# EAGLE design BKU (EAGLE 9.4.2)
ESKD_DESCRIPTION1: 207|235|224|242|224|32|193|209|202|49; ESKD_DESCRIPTION2: 241|245|229|236|224|32|253|235|229|234|242|240|232|247|229|241|234|224|255; ESKD_DESCRIPTION3: 239|240|232|237|246|232|239|232|224|235|252|237|224|255; ESKD_NUMBER: 67|67|83|49|46|50|50|48|48|45|48|221|51; ESKD_NUMBER_SHEET: 49; ESKD_SHEETS: 49
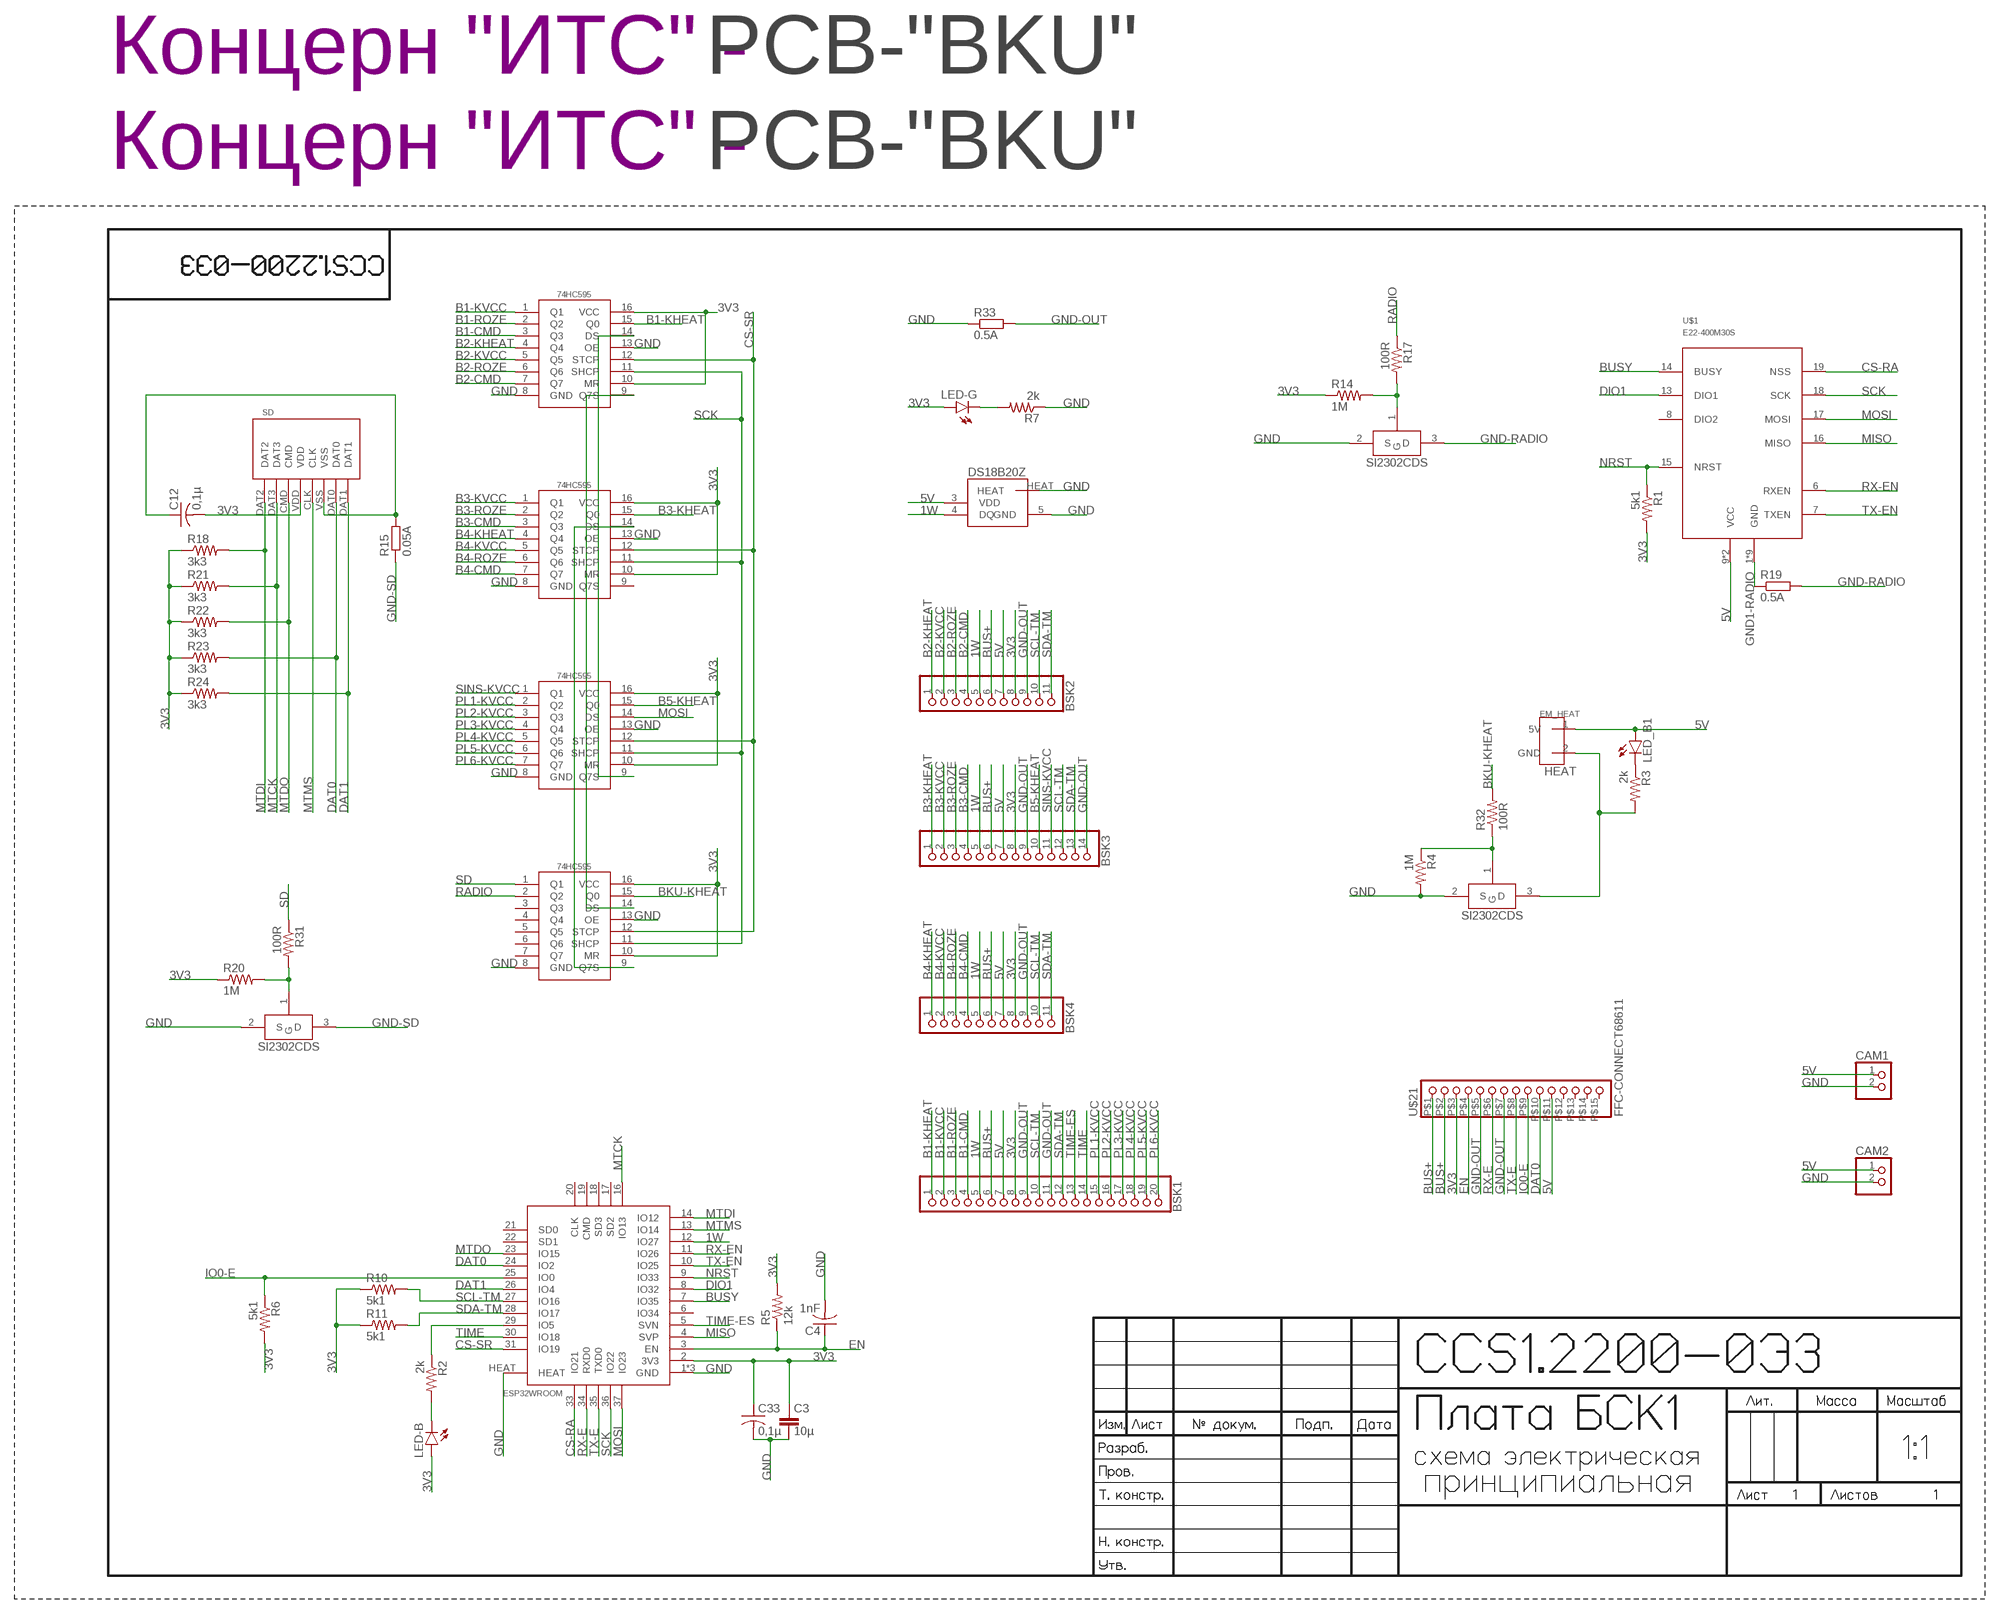
[diagram p0: schematic, sheet 1, part 1 of 2]
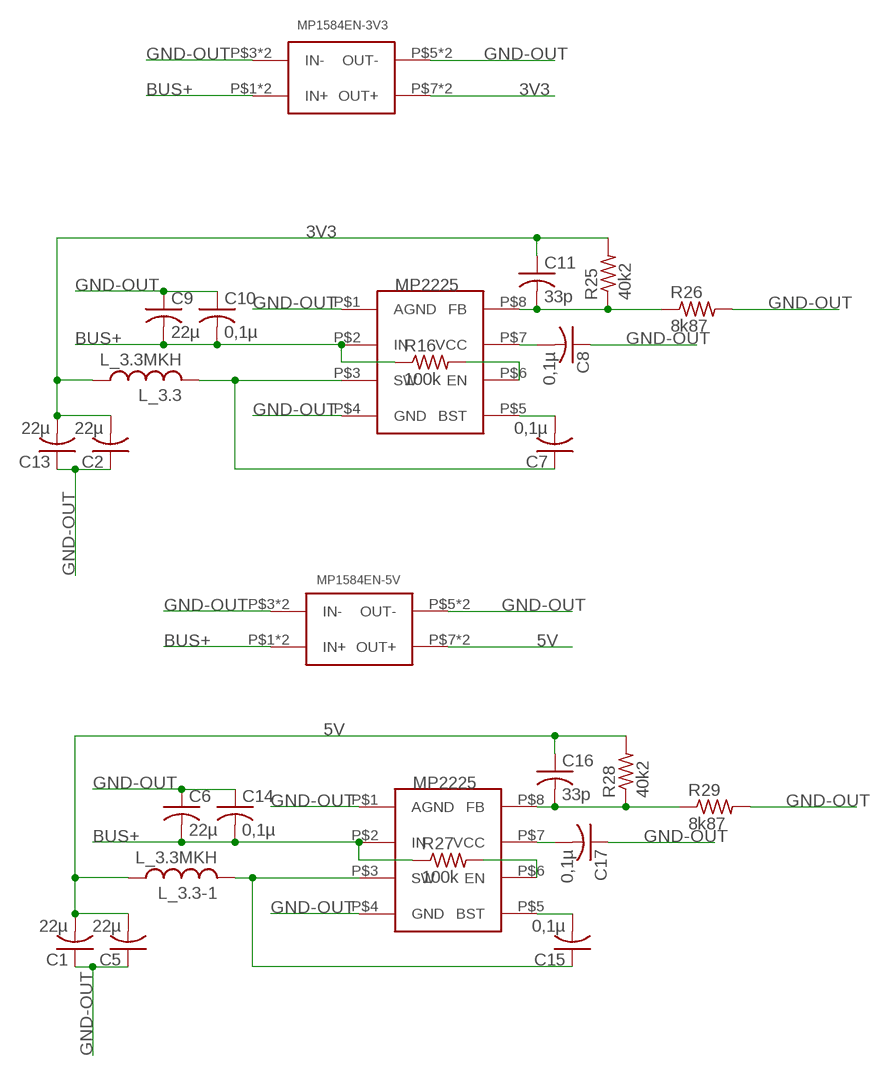
[diagram p1: schematic, sheet 1, part 2 of 2]

## Parts
74HC595#1  74HC595  [TSSOP16]
74HC595#2  74HC595  [TSSOP16]
74HC595#3  74HC595  [TSSOP16]
74HC595#4  74HC595  [TSSOP16]
BSK1  PINHD-1X20  [1X20]
BSK2  PINHD-1X11  [1X11]
BSK3  PINHD-1X14  [1X14]
BSK4  PINHD-1X11  [1X11]
C1  22µ  C-USC1206  [C1206]
C2  22µ  C-USC1206  [C1206]
C3  10µ  C-EUC1206  [C1206]
C4  1nF  C-USC0603  [C0603]
C5  22µ  C-USC1206  [C1206]
C6  22µ  C-USC1206  [C1206]
C7  0,1µ  C-USC0603  [C0603]
C8  0,1µ  C-USC0603  [C0603]
C9  22µ  C-USC1206  [C1206]
C10  0,1µ  C-USC0603  [C0603]
C11  33p  C-USC0603  [C0603]
C12  0,1µ  C-USC0603  [C0603]
C13  22µ  C-USC1206  [C1206]
C14  0,1µ  C-USC0603  [C0603]
C15  0,1µ  C-USC0603  [C0603]
C16  33p  C-USC0603  [C0603]
C17  0,1µ  C-USC0603  [C0603]
C33  0,1µ  C-USC0603  [C0603]
CAM1  PINHD-1X2  [1X02]
CAM2  PINHD-1X2  [1X02]
L_3.3  L_3.3MKH  L_3.3MKH_5X5  [L_SPM5020]
L_3.3-1  L_3.3MKH  L_3.3MKH_5X5  [L_SPM5020]
LED-B  LEDCHIPLED_0603  [CHIPLED_0603]
LED-G  LEDCHIPLED_0603  [CHIPLED_0603]
LED_B1  LEDCHIPLED_0603  [CHIPLED_0603]
MP1584EN-3V3  MP1584-B  [MP1584-B]
MP1584EN-5V  MP1584-B  [MP1584-B]
MP2225-3V3  MP2225  [TSOT23-8]
MP2225-5V  MP2225  [TSOT23-8]
R1  5k1  R-US_R0603  [R0603]
R2  2k  R-US_R0603  [R0603]
R3  2k  R-US_R0603  [R0603]
R4  1M  R-US_R0603  [R0603]
R5  12k  R-US_R0603  [R0603]
R6  5k1  R-US_R0603  [R0603]
R7  2k  R-US_R0603  [R0603]
R10  5k1  R-US_R0603  [R0603]
R11  5k1  R-US_R0603  [R0603]
R14  1M  R-US_R0603  [R0603]
R15  0.05A  R-EU_R1210  [R1210]
R16  100k  R-US_R0603  [R0603]
R17  100R  R-US_R0603  [R0603]
R18  3k3  R-US_R0603  [R0603]
R19  0.5A  R-EU_R1210  [R1210]
R20  1M  R-US_R0603  [R0603]
R21  3k3  R-US_R0603  [R0603]
R22  3k3  R-US_R0603  [R0603]
R23  3k3  R-US_R0603  [R0603]
R24  3k3  R-US_R0603  [R0603]
R25  40k2  R-US_R0603  [R0603]
R26  8k87  R-US_R0603  [R0603]
R27  100k  R-US_R0603  [R0603]
R28  40k2  R-US_R0603  [R0603]
R29  8k87  R-US_R0603  [R0603]
R31  100R  R-US_R0603  [R0603]
R32  100R  R-US_R0603  [R0603]
R33  0.5A  R-EU_R1210  [R1210]
SD  SD  [SD]
U$1  E22-400M30S  [E22-400M30S]
U$2  PCB-"BKU"  ITS-LOGOPCB-""  [ITS-LOGO]
U$3  SI2302CDS  [SOT23-3]
U$4  SI2302CDS  [SOT23-3]
U$5  DS18B20Z  [SOIC8+HEAT_S]
U$6  PCB-"BKU"  ITS-LOGOPCB-""  [ITS-LOGO]
U$13  ESP32WROOM  [ESP32WROOM]
U$21  FFC-CONNECT68611  [68611]
U$23  SI2302CDS  [SOT23-3]
U$24  EM_HEAT  [EM_HEAT]

## Nets
1W: BSK1.5 BSK2.5 BSK3.5 BSK4.5 U$5.4(DQ) U$13.12(IO27)
3: R3.2 U$23.3(D) U$24.2(GND)
3V3: 74HC595#1.10(MR) 74HC595#1.16(VCC) 74HC595#2.10(MR) 74HC595#2.16(VCC) 74HC595#3.10(MR) 74HC595#3.16(VCC) 74HC595#4.10(MR) 74HC595#4.16(VCC) BSK1.8 BSK2.8 BSK3.8 BSK4.8 C2.2 C3.1 C11.1 C12.2 C13.2 C33.1 L_3.3.P$1 LED-B.A LED-G.A MP1584EN-3V3.P$7(OUT+) MP1584EN-3V3.P$8(OUT+) R1.2 R5.2 R6.2 R10.1 R11.1 R14.1 R18.1 R20.1 R21.1 R22.1 R23.1 R24.1 R25.2 SD.VDD U$13.2(3V3) U$21.P$3
5V: BSK1.7 BSK2.7 BSK3.7 BSK4.7 C1.2 C5.2 C16.1 CAM1.1 CAM2.1 L_3.3-1.P$1 LED_B1.A MP1584EN-5V.P$7(OUT+) MP1584EN-5V.P$8(OUT+) R28.2 U$1.9(VCC) U$1.10(VCC) U$5.3(VDD) U$21.P$11 U$24.1(5V)
B1-CMD: 74HC595#1.3(Q3) BSK1.4
B1-KHEAT: 74HC595#1.15(Q0) BSK1.1
B1-KVCC: 74HC595#1.1(Q1) BSK1.2
B1-ROZE: 74HC595#1.2(Q2) BSK1.3
B2-CMD: 74HC595#1.7(Q7) BSK2.4
B2-KHEAT: 74HC595#1.4(Q4) BSK2.1
B2-KVCC: 74HC595#1.5(Q5) BSK2.2
B2-ROZE: 74HC595#1.6(Q6) BSK2.3
B3-CMD: 74HC595#2.3(Q3) BSK3.4
B3-KHEAT: 74HC595#2.15(Q0) BSK3.1
B3-KVCC: 74HC595#2.1(Q1) BSK3.2
B3-ROZE: 74HC595#2.2(Q2) BSK3.3
B4-CMD: 74HC595#2.7(Q7) BSK4.4
B4-KHEAT: 74HC595#2.4(Q4) BSK4.1
B4-KVCC: 74HC595#2.5(Q5) BSK4.2
B4-ROZE: 74HC595#2.6(Q6) BSK4.3
B5-KHEAT: 74HC595#3.15(Q0) BSK3.10
BKU-KHEAT: 74HC595#4.15(Q0) R32.2
BUS+: BSK1.6 BSK2.6 BSK3.6 BSK4.6 C6.2 C9.2 C10.2 C14.2 MP1584EN-3V3.P$1(IN+) MP1584EN-3V3.P$2(IN+) MP1584EN-5V.P$1(IN+) MP1584EN-5V.P$2(IN+) MP2225-3V3.P$2(IN) MP2225-5V.P$2(IN) R16.1 R27.1 U$21.P$1 U$21.P$2
BUSY: U$1.14(BUSY) U$13.7(IO35)
CS-RA: U$1.19(NSS) U$13.33(IO21)
CS-SR: 74HC595#1.12(STCP) 74HC595#2.12(STCP) 74HC595#3.12(STCP) 74HC595#4.12(STCP) U$13.31(IO19)
DAT0: R23.2 SD.DAT0 U$13.24(IO2) U$21.P$10
DAT1: R24.2 SD.DAT1 U$13.26(IO4)
DIO1: U$1.13(DIO1) U$13.8(IO32)
EN: C4.1 R5.1 U$13.3(EN) U$21.P$4
GND: 74HC595#1.8(GND) 74HC595#1.13(OE) 74HC595#2.8(GND) 74HC595#2.13(OE) 74HC595#3.8(GND) 74HC595#3.13(OE) 74HC595#4.8(GND) 74HC595#4.13(OE) C3.2 C4.2 C33.2 CAM1.2 CAM2.2 R4.2 R7.1 R33.1 U$3.2(S) U$4.2(S) U$5.5(GND) U$5.HEAT U$13.1(GND) U$13.15(GND) U$13.38(GND) U$13.HEAT U$23.2(S)
GND1-RADIO: R19.1 U$1.1(GND) U$1.2(GND) U$1.3(GND) U$1.4(GND) U$1.5(GND) U$1.11(GND) U$1.12(GND) U$1.20(GND) U$1.22(GND)
GND-OUT: BSK1.9 BSK1.11 BSK2.9 BSK3.9 BSK3.14 BSK4.9 C1.1 C2.1 C5.1 C6.1 C8.1 C9.1 C10.1 C13.1 C14.1 C17.1 MP1584EN-3V3.P$3(IN-) MP1584EN-3V3.P$4(IN-) MP1584EN-3V3.P$5(OUT-) MP1584EN-3V3.P$6(OUT-) MP1584EN-5V.P$3(IN-) MP1584EN-5V.P$4(IN-) MP1584EN-5V.P$5(OUT-) MP1584EN-5V.P$6(OUT-) MP2225-3V3.P$1(AGND) MP2225-3V3.P$4(GND) MP2225-5V.P$1(AGND) MP2225-5V.P$4(GND) R26.2 R29.2 R33.2 U$21.P$5 U$21.P$7
GND-RADIO: R19.2 U$4.3(D)
GND-SD: R15.1 U$3.3(D)
IO0-E: R6.1 U$13.25(IO0) U$21.P$9
IO1: R2.1 U$13.29(IO5)
MISO: U$1.16(MISO) U$13.4(SVP)
MOSI: 74HC595#3.14(DS) U$1.17(MOSI) U$13.37(IO23)
MTCK: R21.2 SD.DAT3 U$13.16(IO13)
MTDI: R18.2 SD.DAT2 U$13.14(IO12)
MTDO: R22.2 SD.CMD U$13.23(IO15)
MTMS: SD.CLK U$13.13(IO14)
N$1: 74HC595#1.9(Q7S) 74HC595#4.14(DS)
N$2: LED_B1.C R3.1
N$3: LED-G.C R7.2
N$4: LED-B.C R2.2
N$5: C12.1 R15.2 SD.VSS
N$6: R14.2 R17.2 U$4.1(G)
N$7: 74HC595#2.14(DS) 74HC595#4.9(Q7S)
N$8: C15.1 L_3.3-1.P$2 MP2225-5V.P$3(SW)
N$9: C15.2 MP2225-5V.P$5(BST)
N$10: MP2225-5V.P$6(EN) R27.2
N$11: R20.2 R31.2 U$3.1(G)
N$12: C17.2 MP2225-5V.P$7(VCC)
N$13: C7.2 MP2225-3V3.P$5(BST)
N$14: C7.1 L_3.3.P$2 MP2225-3V3.P$3(SW)
N$15: MP2225-3V3.P$6(EN) R16.2
N$16: C8.2 MP2225-3V3.P$7(VCC)
N$17: 74HC595#1.14(DS) 74HC595#3.9(Q7S)
N$20: C11.2 MP2225-3V3.P$8(FB) R25.1 R26.1
N$22: C16.2 MP2225-5V.P$8(FB) R28.1 R29.1
N$36: R4.1 R32.1 U$23.1(G)
NRST: R1.1 U$1.15(NRST) U$13.9(IO33)
PL1-KVCC: 74HC595#3.2(Q2) BSK1.15
PL2-KVCC: 74HC595#3.3(Q3) BSK1.16
PL3-KVCC: 74HC595#3.4(Q4) BSK1.17
PL4-KVCC: 74HC595#3.5(Q5) BSK1.18
PL5-KVCC: 74HC595#3.6(Q6) BSK1.19
PL6-KVCC: 74HC595#3.7(Q7) BSK1.20
RADIO: 74HC595#4.2(Q2) R17.1
RX-E: U$13.34(RXD0) U$21.P$6
RX-EN: U$1.6(RXEN) U$13.11(IO26)
SCK: 74HC595#1.11(SHCP) 74HC595#2.11(SHCP) 74HC595#3.11(SHCP) 74HC595#4.11(SHCP) U$1.18(SCK) U$13.36(IO22)
SCL-TM: BSK1.10 BSK2.10 BSK3.12 BSK4.10 R10.2 U$13.27(IO16)
SD: 74HC595#4.1(Q1) R31.1
SDA-TM: BSK1.12 BSK2.11 BSK3.13 BSK4.11 R11.2 U$13.28(IO17)
SINS-KVCC: 74HC595#3.1(Q1) BSK3.11
TIME: BSK1.14 U$13.30(IO18)
TIME-ES: BSK1.13 U$13.5(SVN)
TX-E: U$13.35(TXD0) U$21.P$8
TX-EN: U$1.7(TXEN) U$13.10(IO25)
Unconnected: 74HC595#2.9(Q7S) 74HC595#4.3(Q3) 74HC595#4.4(Q4) 74HC595#4.5(Q5) 74HC595#4.6(Q6) 74HC595#4.7(Q7) U$1.8(DIO2) U$13.6(IO34) U$13.17(SD2) U$13.18(SD3) U$13.19(CMD) U$13.20(CLK) U$13.21(SD0) U$13.22(SD1) U$21.P$12 U$21.P$13 U$21.P$14 U$21.P$15

## Notes on the sheet
- HEAT

## Library data of the parts
74HC595#1-74HC595#4 = CanCubeSat:74HC595
BSK1 = pinheadCS:PINHD-1X20: PIN HEADER
BSK2 BSK4 = pinheadCS:PINHD-1X11: PIN HEADER
BSK3 = pinheadCS:PINHD-1X14: PIN HEADER
C1 C2 C4-C17 C33 = rcl:C-US: CAPACITOR, American symbol; SPICEPREFIX: C
C3 = rcl:C-EU: CAPACITOR, European symbol; SPICEPREFIX: C
CAM1 CAM2 = pinheadCS:PINHD-1X2: PIN HEADER
L_3.3 L_3.3-1 = CanCubeSat:L_3.3MKH_5X5
LED-B LED-G LED_B1 = led:LED: LED OSRAM: - CHIPLED LG R971, LG N971, LY N971, LG Q971, LY Q971, LO R971, LY R971 LH N974, LH R974 LS Q976, LO Q976, LY Q976 LO Q996 - Hyper CHIPLED LW Q18S LB Q993, LB Q99A, LB R99A - SideLED LS A670, LO A670, LY A670, LG A670, LP A670 LB A673, LV A673, LT A673, LW A673 LH A674 LY A675 LS A676, LA A676, LO A676, LY A676, LW A676 LS A679, LY A679, LG A679 - Hyper Micro SIDELED® LS Y876, LA Y876, LO Y876, LY Y876 LT Y87S - SmartLED LW L88C, LW L88S LB L89C, LB L89S, LG L890 LS L89K, LO L89K, LY L89K LS L896, LA L896, LO L896, LY L896 - TOPLED LS T670, LO T670, LY T670, LG T670, LP T670 LSG T670, LSP T670, LSY T670, LOP T670, LYG T670 LG T671, LOG T671, LSG T671 LB T673, LV T673, LT T673, LW T673 LH T674 LS T676, LA T676, LO T676, LY T676, LB T676, LH T676, LSB T676, LW T676 LB T67C, LV T67C, LT T67C, LS T67K, LO T67K, LY T67K, LW E67C LS E67B, LA E67B, LO E67B, LY E67B, LB E67C, LV E67C, LT E67C LW T67C LS T679, LY T679, LG T679 LS T770, LO T770, LY T770, LG T770, LP T770 LB T773, LV T773, LT T773, LW T773 LH T774 LS E675, LA E675, LY E675, LS T675 LS T776, LA T776, LO T776, LY T776, LB T776 LHGB T686 LT T68C, LB T68C - Hyper Mini TOPLED® LB M676 - Mini TOPLED Santana® LG M470 LS M47K, LO M47K, LY M47K Source: http://www.osram.convergy.de LUXEON: - LUMILED® LXK2-PW12-R00, LXK2-PW12-S00, LXK2-PW14-U00, LXK2-PW14-V00 LXK2-PM12-R00, LXK2-PM12-S00, LXK2-PM14-U00 LXK2-PE12-Q00, LXK2-PE12-R00, LXK2-PE12-S00, LXK2-PE14-T00, LXK2-PE14-U00 LXK2-PB12-K00, LXK2-PB12-L00, LXK2-PB12-M00, LXK2-PB14-N00, LXK2-PB14-P00, LXK2-PB14-Q00 LXK2-PR12-L00, LXK2-PR12-M00, LXK2-PR14-Q00, LXK2-PR14-R00 LXK2-PD12-Q00, LXK2-PD12-R00, LXK2-PD12-S00 LXK2-PH12-R00, LXK2-PH12-S00 LXK2-PL12-P00, LXK2-PL12-Q00, LXK2-PL12-R00 Source: www.luxeon.com KINGBRIGHT: KA-3528ASYC Source: www.kingbright.com
MP1584EN-3V3 MP1584EN-5V = CanCubeSat:MP1584-B
MP2225-3V3 MP2225-5V = CanCubeSat:MP2225
R1-R7 R10 R11 R14 R16-R18 R20-R29 R31 R32 = resistor:R-US_: RESISTOR, American symbol
R15 R19 R33 = rcl:R-EU_: RESISTOR, European symbol; SPICEPREFIX: R
SD = CanCubeSat:SD
U$1 = CanCubeSat:E22-400M30S: EBYTE E22400M30S radio module Datasheet and info: http://www.ebyte.com/en/product-view-news.aspx?id=454
U$2 U$6 = CanCubeSat:ITS-LOGO
U$3 U$4 U$23 = CanCubeSat:SI2302CDS
U$5 = CanCubeSat:DS18B20Z
U$13 = CanCubeSat:ESP32WROOM
U$21 = CanCubeSat:FFC-CONNECT
U$24 = CanCubeSat:EM_HEAT

## Board
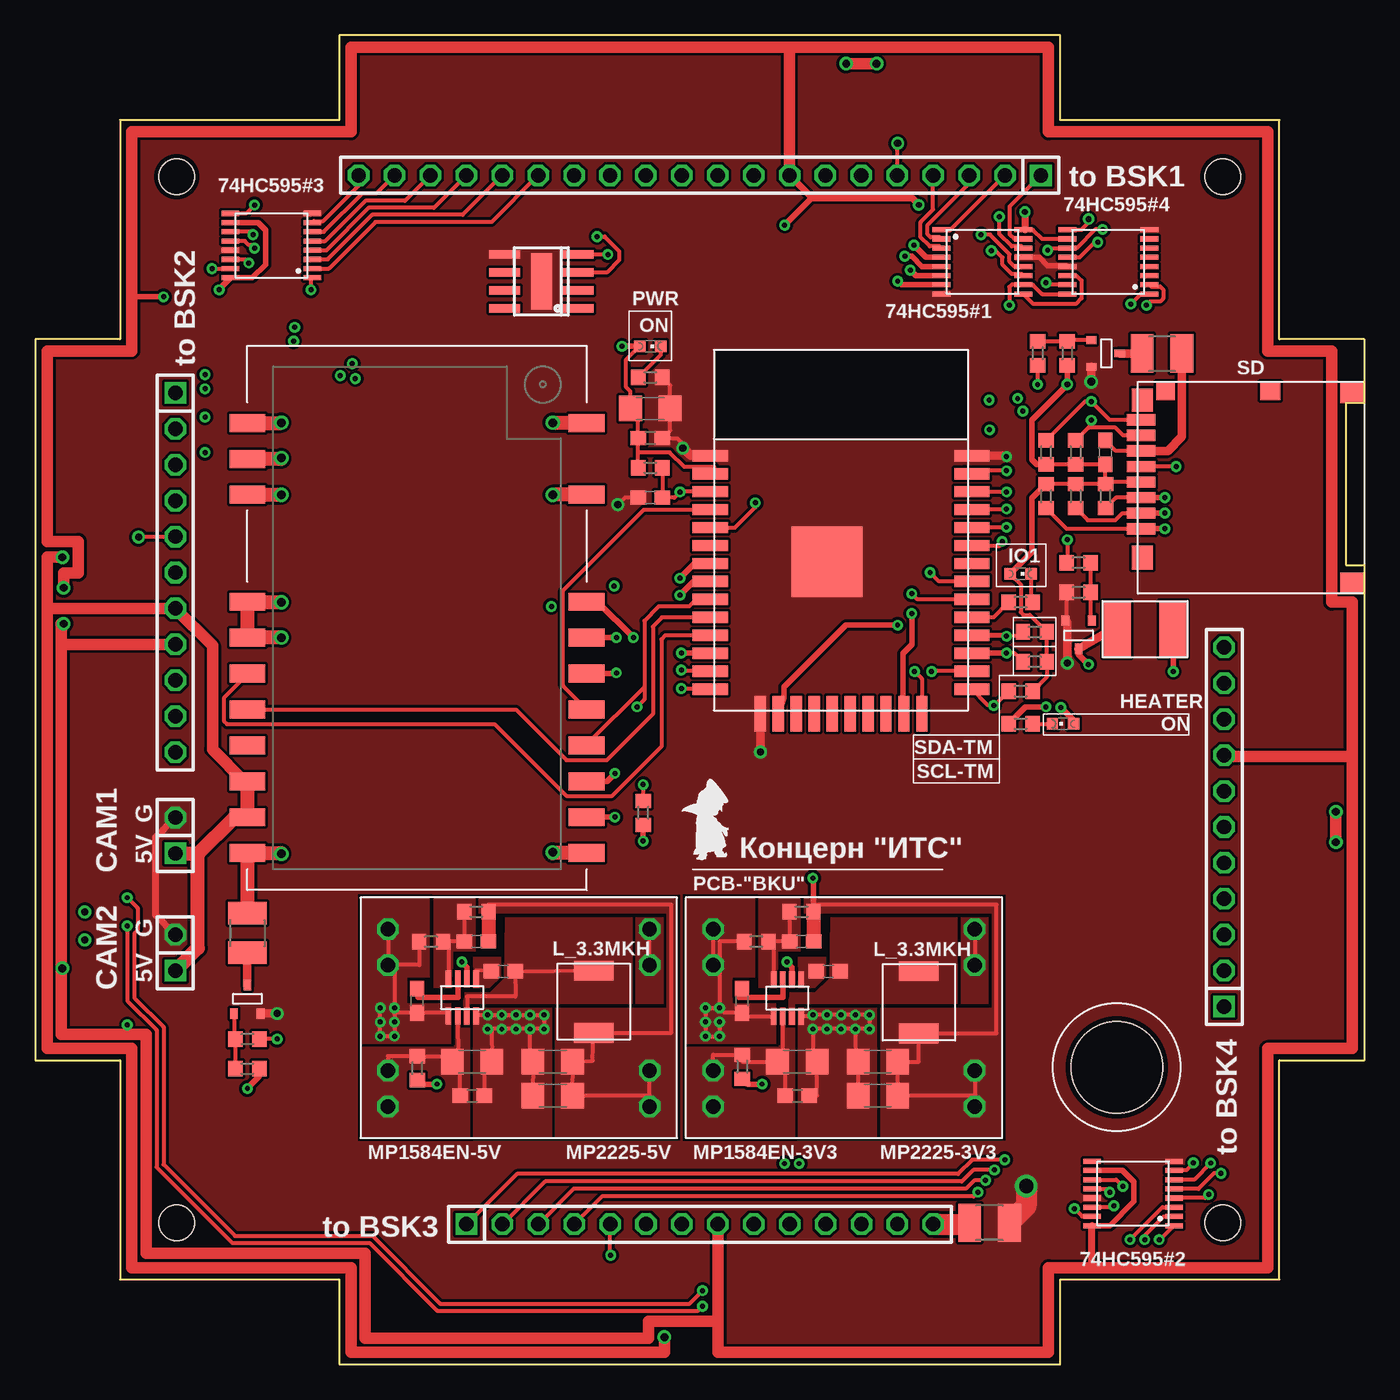
[diagram p2: board, top side]
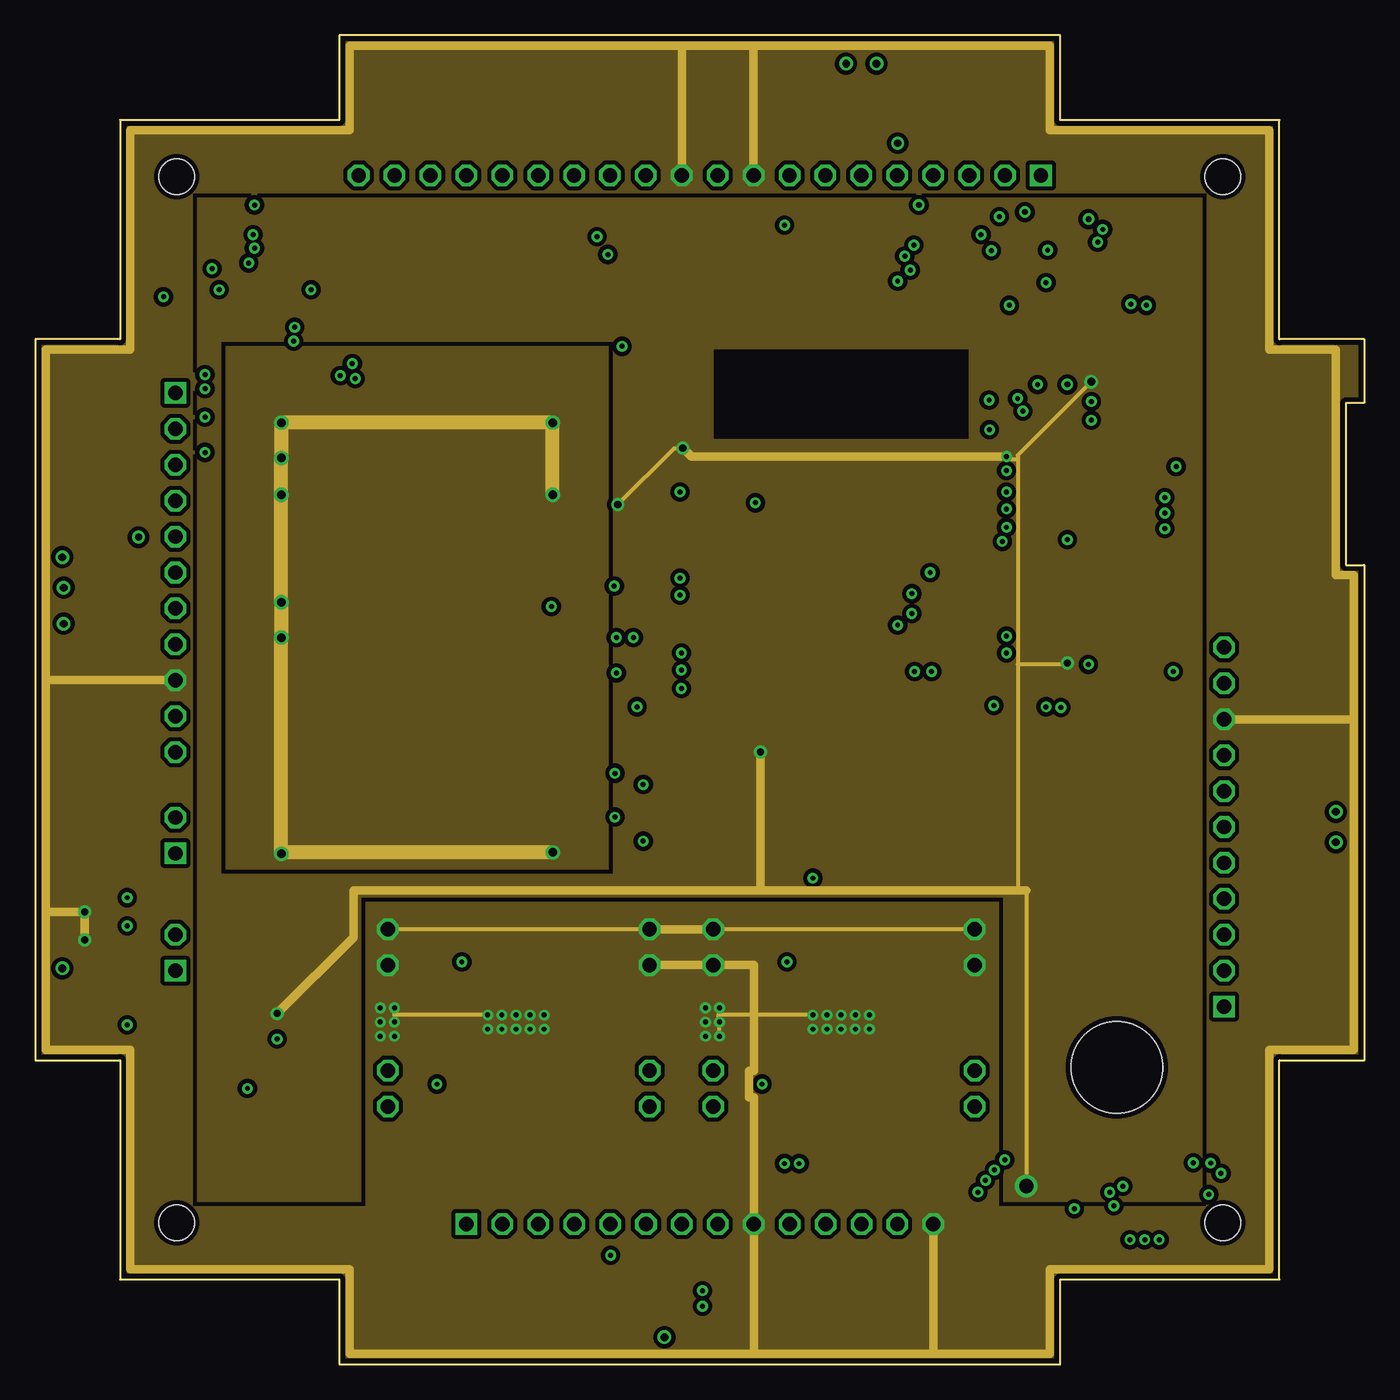
[diagram p3: board, inner layer Route2]
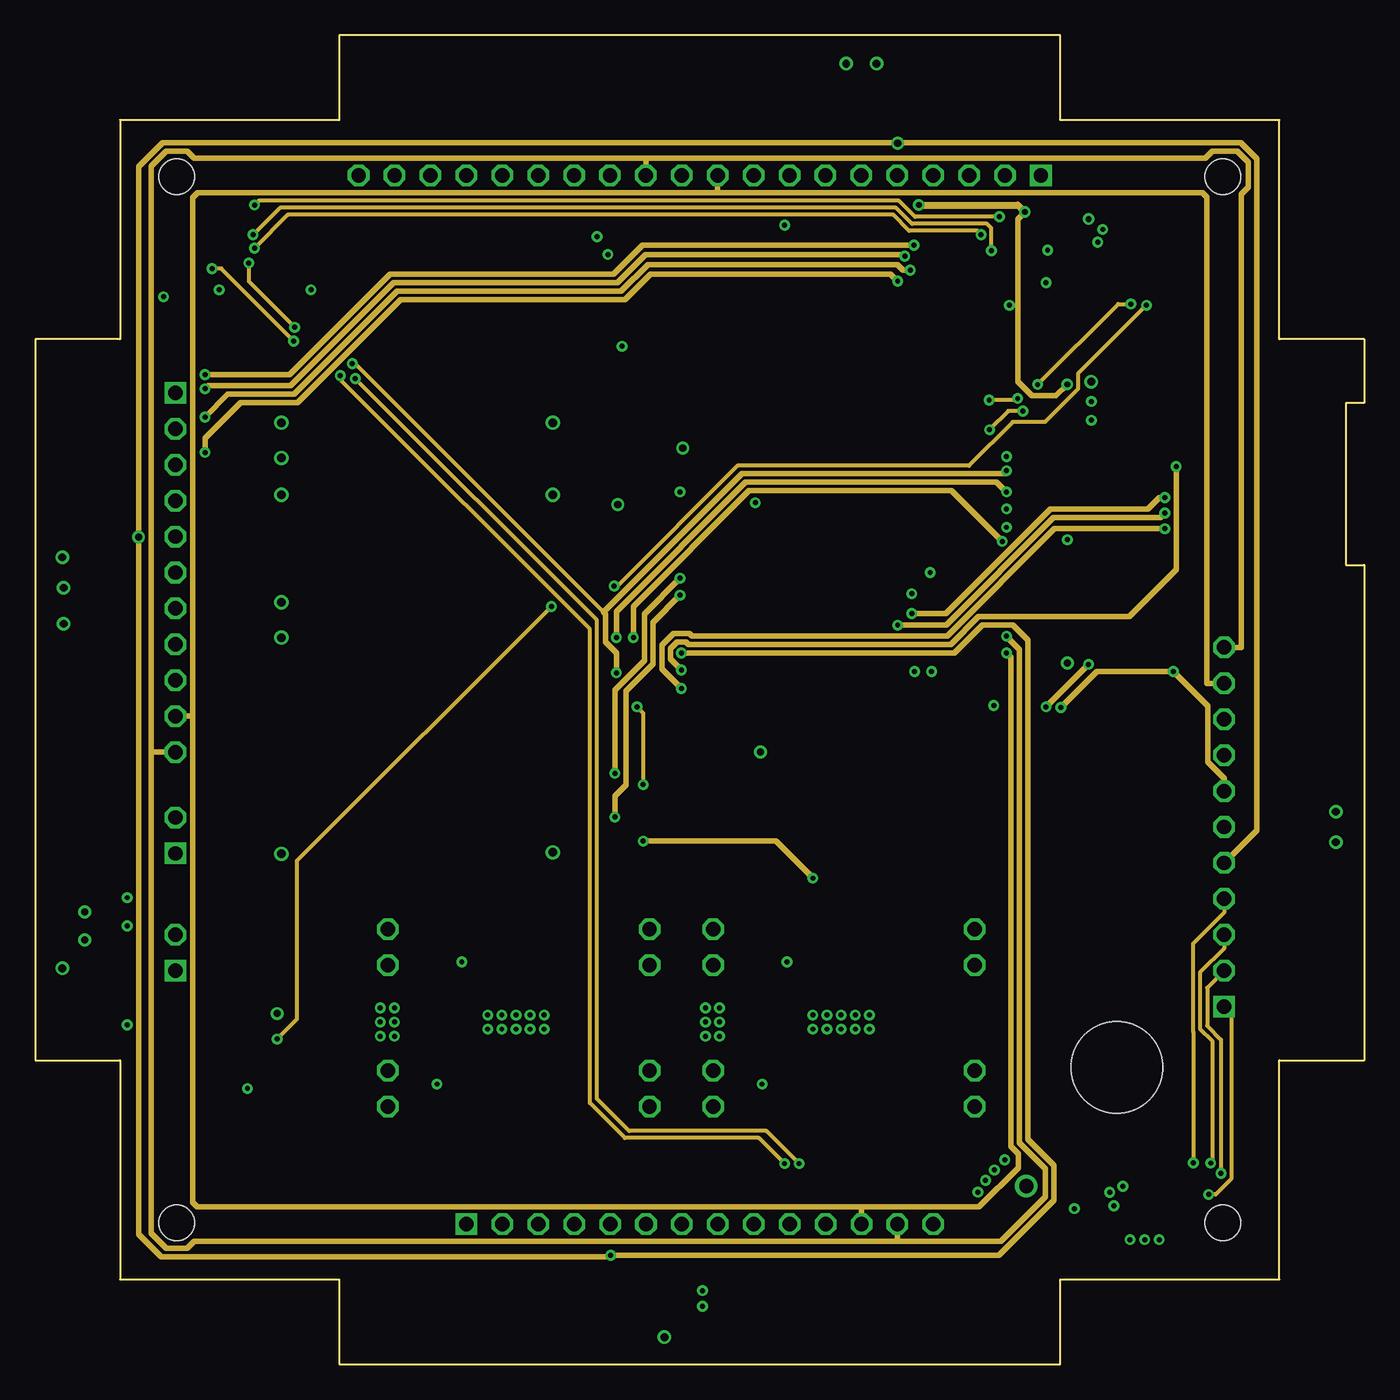
[diagram p4: board, inner layer Route15]
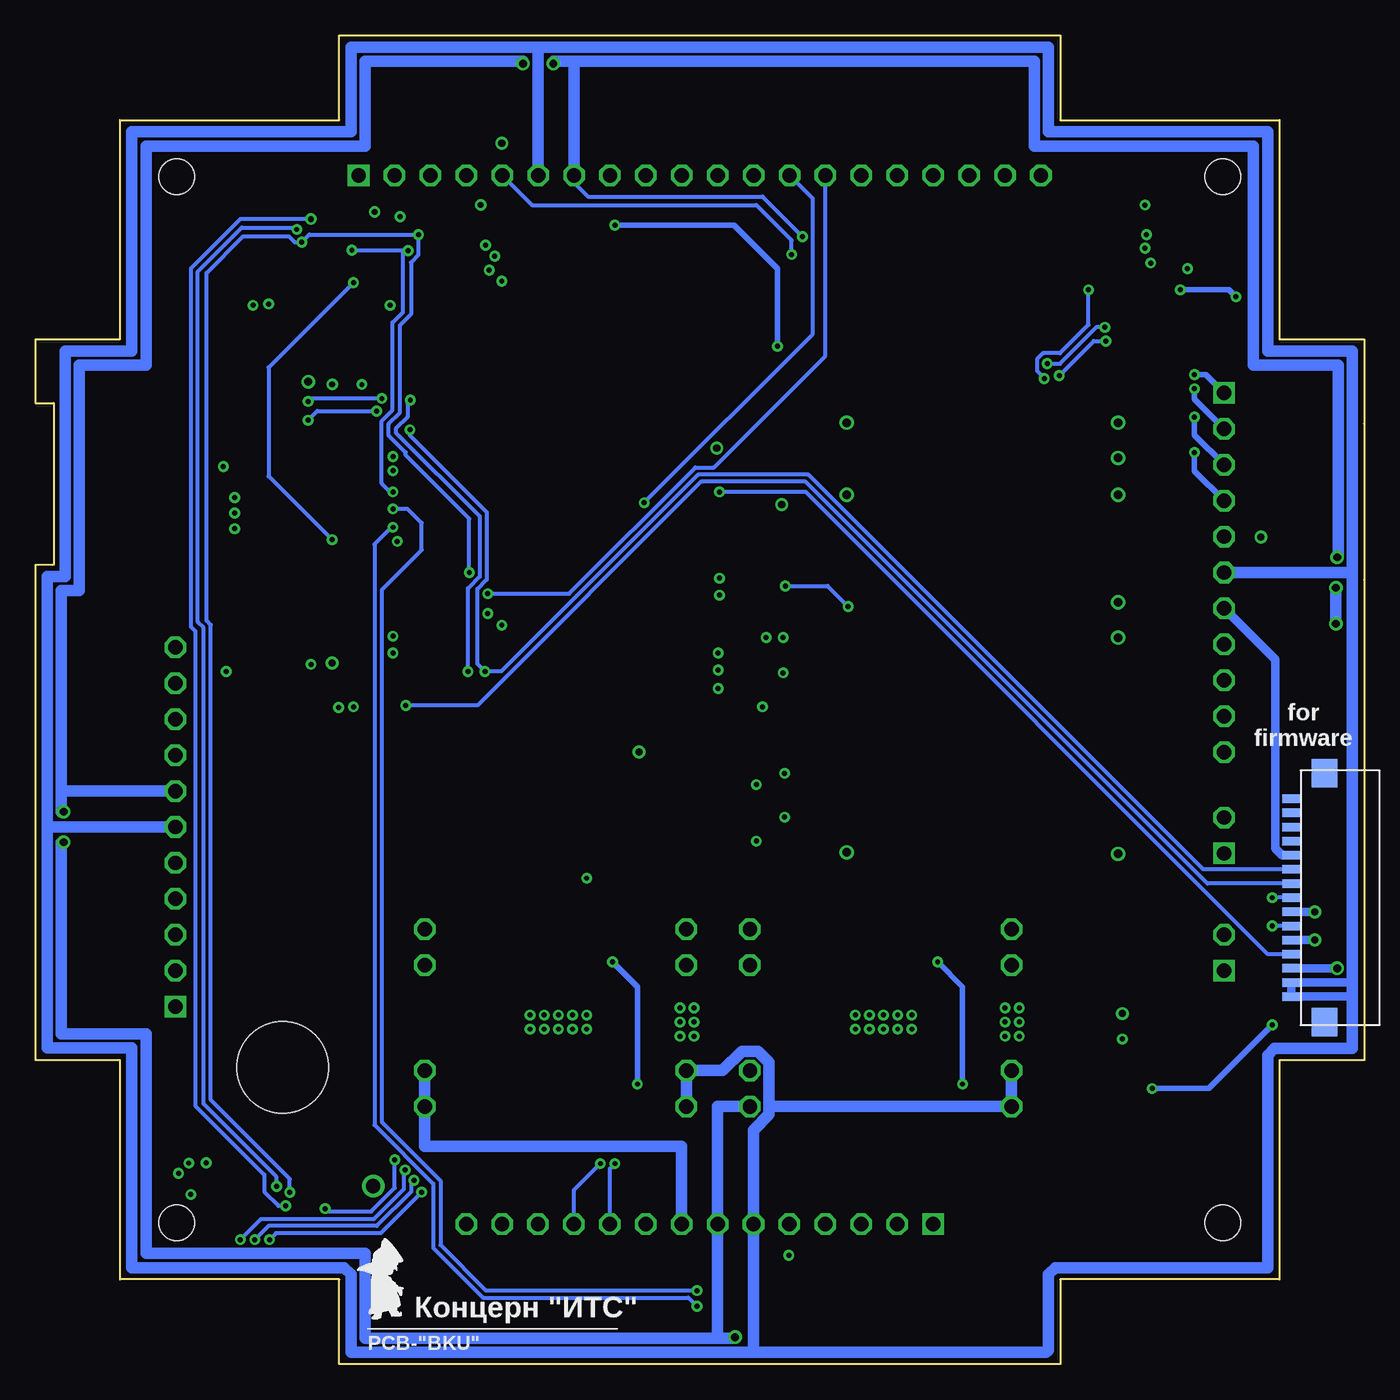
[diagram p5: board, bottom side, seen from below]

Size 94 x 94 mm. Coordinates in mm from the lower left corner, seen from the top.
Outline: 94,68 94,72.5 88,72.5 88,88 72.5,88 72.5,94 21.5,94 21.5,88 6,88 6,72.5 0,72.5 0,66.5 0,55.5 0,21.5 6,21.5 6,6 21.5,6 21.5,0 72.5,0 72.5,6 88,6 88,21.5 94,21.5 94,56.54
Copper layers (1+2*15+16): Top 0.035mm / dielectric 1.5mm / Route2 0.035mm / dielectric 0.15mm / Route15 0.035mm / dielectric 0.2mm / Bottom 0.035mm
Design rules "default *": minimum track width 0.3mm, minimum drill 0.35mm, track to track 0.2mm, track to pad 0.2mm, pad to pad 0.2mm, via to via 0.2mm, smd to smd 0.2mm, copper to edge 0.35mm, drill to drill 0.2mm, minimum pad ring 10mil, minimum via ring 8mil, stop-mask expansion 2mil, vias tented up to drill 0mil, thermal gap 10mil
Holes 6.5 mm at 76.5,21
Holes 2.5 mm at 10,10 84,84 10,84 84,10

### Footprints (pad centres in the part's own frame; a part is rotated, then mirrored left to right if it is on the bottom)
TSSOP16 = smd 1.26 x 0.36: 1 -2.9,2.275; 2 -2.9,1.625; 3 -2.9,0.975; 4 -2.9,0.325; 5 -2.9,-0.325; 6 -2.9,-0.975; 7 -2.9,-1.625; 8 -2.9,-2.275; 9 2.9,-2.275; 10 2.9,-1.625; 11 2.9,-0.975; 12 2.9,-0.325; 13 2.9,0.325; 14 2.9,0.975; 15 2.9,1.625; 16 2.9,2.275
1X20 = drill 1.016 square: 1 -24.13,0 | drill 1.016 octagon: 2 -21.59,0; 3 -19.05,0; 4 -16.51,0; 5 -13.97,0; 6 -11.43,0; 7 -8.89,0; 8 -6.35,0; 9 -3.81,0; 10 -1.27,0; 11 1.27,0; 12 3.81,0; 13 6.35,0; 14 8.89,0; 15 11.43,0; 16 13.97,0; 17 16.51,0; 18 19.05,0; 19 21.59,0; 20 24.13,0
1X11 = drill 1.016 square: 1 -12.7,0 | drill 1.016 octagon: 2 -10.16,0; 3 -7.62,0; 4 -5.08,0; 5 -2.54,0; 6 0,0; 7 2.54,0; 8 5.08,0; 9 7.62,0; 10 10.16,0; 11 12.7,0
1X14 = drill 1.016 square: 1 -16.51,0 | drill 1.016 octagon: 2 -13.97,0; 3 -11.43,0; 4 -8.89,0; 5 -6.35,0; 6 -3.81,0; 7 -1.27,0; 8 1.27,0; 9 3.81,0; 10 6.35,0; 11 8.89,0; 12 11.43,0; 13 13.97,0; 14 16.51,0
C1206 = smd 1.6 x 1.8: 1 -1.4,0; 2 1.4,0
C0603 = smd 1.1 x 1: 1 -0.85,0; 2 0.85,0
1X02 = drill 1.016 square: 1 -1.27,0 | drill 1.016 octagon: 2 1.27,0
L_SPM5020 = smd 1.4 x 2.8: P$1 -2.2,0; P$2 2.2,0
CHIPLED_0603 = smd 0.8 x 0.8: A 0,-0.75; C 0,0.75
MP1584-B = drill 1.016 octagon: P$1 1.95,2.23; P$2 1.95,4.77; P$3 1.95,12.23; P$4 1.95,14.77; P$5 20.45,14.77; P$6 20.45,12.23; P$7 20.45,4.77; P$8 20.45,2.23
TSOT23-8 = smd 0.4 x 1.2: P$1 -0.975,-1.3; P$2 -0.325,-1.3; P$3 0.325,-1.3; P$4 0.975,-1.3; P$5 0.975,1.3; P$6 0.325,1.3; P$7 -0.325,1.3; P$8 -0.975,1.3
R0603 = smd 1 x 1.1: 1 -0.85,0; 2 0.85,0
R1210 = smd 1.6 x 2.7: 1 -1.4,0; 2 1.4,0
SD = smd 0.8 x 2: CLK 6,-15.77; CMD 8.2,-15.77; DAT0 3.8,-15.77; DAT1 2.7,-15.77; DAT2 10.4,-15.77; DAT3 9.3,-15.77; VDD 7.1,-15.77; VSS 4.9,-15.77 | smd 1.5 x 1.7: P$9 0.75,-0.85; P$13 14.25,-0.85 | smd 1.6 x 1.5: P$10 1.3,-15.7 | smd 1.29 x 1.3: P$11 0.645,-14.05 | smd 1.29 x 1.4: P$12 0.645,-6.65 | smd 1.7 x 1.5: P$14 12.45,-15.7
E22-400M30S = smd 2.54 x 1.27: 1 12,-13.79; 2 12,-11.25; 3 12,-8.71; 4 12,-1.14; 5 12,1.4; 6 12,3.94; 7 12,6.48; 8 12,9.02; 9 12,11.56; 10 12,14.1; 11 12,16.64; 12 -12,16.64; 13 -12,14.1; 14 -12,11.56; 15 -12,9.02; 16 -12,6.48; 17 -12,3.94; 18 -12,1.4; 19 -12,-1.14; 20 -12,-8.71; 22 -12,-13.79
SOT23-3 = smd 0.56 x 0.73: 1 -0.95,-1; 2 0.95,-1; 3 0,1
SOIC8+HEAT_S = smd 0.6 x 2.2: 1 -1.905,-2.6; 2 -0.635,-2.6; 3 0.635,-2.6; 4 1.905,-2.6; 5 1.905,2.6; 6 0.635,2.6; 7 -0.635,2.6; 8 -1.905,2.6 | smd 4 x 1.5: HEAT 0,0
ESP32WROOM = smd 2.5 x 0.8: 1 -9.25,5.26; 2 -9.25,3.99; 3 -9.25,2.72; 4 -9.25,1.45; 5 -9.25,0.18; 6 -9.25,-1.09; 7 -9.25,-2.36; 8 -9.25,-3.63; 9 -9.25,-4.9; 10 -9.25,-6.17; 11 -9.25,-7.44; 12 -9.25,-8.71; 13 -9.25,-9.98; 14 -9.25,-11.25; 25 9.25,-11.25; 26 9.25,-9.98; 27 9.25,-8.71; 28 9.25,-7.44; 29 9.25,-6.17; 30 9.25,-4.9; 31 9.25,-3.63; 32 9.25,-2.36; 33 9.25,-1.09; 34 9.25,0.18; 35 9.25,1.45; 36 9.25,2.72; 37 9.25,3.99; 38 9.25,5.26 | smd 0.8 x 2.5: 15 -5.715,-13; 16 -4.445,-13; 17 -3.175,-13; 18 -1.905,-13; 19 -0.635,-13; 20 0.635,-13; 21 1.905,-13; 22 3.175,-13; 23 4.445,-13; 24 5.715,-13 | smd 5.01 x 5.01: HEAT -1.01,-2.24
68611 = smd 0.6 x 1.3: P$1 -7,0.65; P$2 -6,0.65; P$3 -5,0.65; P$4 -4,0.65; P$5 -3,0.65; P$6 -2,0.65; P$7 -1,0.65; P$8 0,0.65; P$9 1,0.65; P$10 2,0.65; P$11 3,0.65; P$12 4,0.65; P$13 5,0.65; P$14 6,0.65; P$15 7,0.65 | smd 2 x 1.8: P$16 8.8,-1.7; P$17 -8.8,-1.7
EM_HEAT = smd 2 x 4: 1 -2,0; 2 2,0

### Placement (x,y rotation side)
74HC595#1  67,77.97 0 top
74HC595#2  77.65,12.07 180 top
74HC595#3  16.7,79.12 180 top
74HC595#4  75.9,77.97 180 top
BSK1  47,84.1 180 top
BSK2  9.9,56 270 top
BSK3  47.01,9.9 0 top
BSK4  84.1,38 90 top
C1  36.6,19 0 top
C2  59.6,21.4 0 top
C3  43.5,67.6 0 top
C4  43.5,61.3 180 top
C5  36.6,21.4 0 top
C6  30.9,21.4 180 top
C7  56.1,27.8 180 top
C8  50,25.7 90 top
C9  53.9,21.4 180 top
C10  53.9,19 180 top
C11  54.2,29.9 180 top
C12  75.7,64.5 270 top
C13  59.6,19 0 top
C14  30.9,19 180 top
C15  33.1,27.8 180 top
C16  31.2,29.9 180 top
C17  27,25.7 90 top
C33  43.5,65.5 0 top
CAM1  9.9,37.4 90 top
CAM2  9.9,29.1 90 top
L_3.3  62.5,25.6 90 top
L_3.3-1  39.5,25.64 90 top
LED-B  69.7,55.9 270 top
LED-G  43.5,72 270 top
LED_B1  72.7,45.3 90 top
MP1584EN-3V3  46,16 0 top
MP1584EN-5V  23,16 0 top
MP2225-3V3  53.2,25.9 0 top
MP2225-5V  30.2,25.94 0 top
R1  43,39 270 top
R2  69.7,53.9 0 top
R3  69.7,45.3 180 top
R4  73.8,54.6 180 top
R5  43.5,63.4 180 top
R6  69.7,47.6 0 top
R7  43.5,69.8 180 top
R10  70.7,49.7 180 top
R11  70.7,51.8 180 top
R14  15,20.9 180 top
R15  79.7,71.5 0 top
R16  50.02,21.04 270 top
R17  15,23 180 top
R18  71.5,61.4 270 top
R19  15,30.5 270 top
R20  73,71.5 90 top
R21  73.6,61.4 270 top
R22  75.7,61.4 270 top
R23  73.6,64.5 90 top
R24  71.5,64.5 90 top
R25  54.2,32 0 top
R26  51,29.9 180 top
R27  27.02,20.94 270 top
R28  31.2,32 0 top
R29  28,29.9 180 top
R31  70.9,71.5 90 top
R32  73.8,56.7 180 top
R33  67.5,10 180 top
SD  94,69.5 270 top
U$1  27,52.79 180 top
U$2  46.5,35 0 top
U$3  75.7,71.5 270 top
U$4  15,25.8 0 top
U$5  35.8,76.59 90 top
U$6  70.5,2.5 0 bottom
U$13  57,59 0 top
U$21  4.5,33 90 bottom
U$23  73.8,51.6 180 top
U$24  78.5,52 180 top

### Tracks (layer width: path | path; a pad name or v marks a point on that pad's centre or on a via)
1W  (via drill 0.35, 0.5)
  Top 0.3: BSK1.5 60.97,86.34 v61,86.37 | v7.3,58.5 7.34,58.54 BSK2.5 | 40.66,7.74 BSK3.5 | v40.5,78.5 U$5.4
  Top 0.4: v40.7,7.7 40.66,7.74 | U$13.12 48.49,50.3 v45.7,50.3
  Route15 0.4: BSK4.5 86.4,37.76 86.4,85.26 85.26,86.4 61.03,86.4 v61,86.37 60.97,86.4 9.01,86.4 7.3,84.69 v7.3,58.5 7.3,9.2 8.9,7.6 40.6,7.6 v40.7,7.7 68.17,7.7 72.05,11.58 72.05,14.05 70.2,15.9 70.2,51.22 69.14,52.28 66.98,52.28 65,50.3 v45.7,50.3
  Bottom 0.3: BSK1.5 58.87,82 43,82 40.5,79.5 v40.5,78.5
3  (via drill 0.35)
  Top 0.4: R3.2 70.05,46.5 v71.5,46.5 | v74.5,49.5 73.8,50.2 U$23.3
  Top 0.6: U$23.3 76.4,52.1 U$24.2
  Route15 0.4: v71.5,46.5 v74.5,49.5
3V3  (via drill 0.35, 0.4, 0.55)
  Top 0.3: R25.2 55.05,32.5 68,32.5 68,23.4 L_3.3.P$1 62.5,21.4 C2.2 C13.2 66.45,19 | MP1584EN-3V3.P$7 66.45,19 | 66.45,19 MP1584EN-3V3.P$8 | SD.VDD 75.7,62.4 R22.1 | R22.1 C12.2 R23.1 R24.1 | R22.1 R21.1 R18.1 | LED-B.A 69.7,55.15 69.7,53.2 69.91,53 70.35,53 R11.1 R10.1 71.55,48.6 R6.2 | R5.2 42.65,64.5 | 42.65,64.5 C33.1 42.65,67.05 C3.1 42.1,68.81 41.8,69.11 41.8,71.05 LED-G.A | U$13.2 48.03,63.46 45.9,63.46 44.86,64.5 42.65,64.5 | 74HC595#1.16 69.92,80.23 70,80.23 70.58,80.23 71.2,79.6 74HC595#4.10 | 74HC595#4.16 71.2,75.7 70.58,76.33 69.92,76.33 74HC595#1.10 69.05,76.35 68.9,76.2 v68.9,74.9
  Top 0.4: R20.1 v73,69.3 70.5,66.8 70.5,64 70.85,63.65 R24.1 | 74HC595#2.10 76.91,13.7 77.71,12.89 77.71,11.51 76,9.8 74HC595#2.16 | 74HC595#3.10 15.75,80.75 16.28,80.22 16.28,77.78 15.35,76.85 74HC595#3.16 13,76.05 v13,76 | R14.1 15.85,20.35 v15,19.5 | v6.5,24 6.5,23.33 | v9.06,75.5 6.83,75.5 | R1.2 v43,37 | v55,34.38 55.05,34.33 R25.2 | LED-B.A 70.5,57.45 70.5,61.25 R18.1 | 54.95,82.5 54.93,82.5 v53,80.57 | LED-G.A v41.5,72
  Top 0.5: BSK1.8 54.95,82.5 62,82.5 v62.5,82 | v70,81.5 70,80.23 | 75,6.83 74.75,7.08 74HC595#2.16
  Top 0.6: v1.9,28 1.82,28
  Top 0.8: BSK3.8 48.28,3.03 | 93.17,43 93.17,53.9 91.7,53.9 91.7,71.67 87.17,71.67 87.17,87.17 71.67,87.17 71.67,93.17 53.35,93.17 | v2,54.92 2,55.95 3.03,55.95 3.03,58.21 0.83,58.21 0.83,71.67 6.83,71.67 6.83,75.5 6.83,87.17 22.33,87.17 22.33,93.17 53.35,93.17 | v2,52.38 1.82,52.38 1.82,50.92 | 48.28,3.03 43.37,3.03 43.37,1.83 23.33,1.83 23.33,7.83 7.83,7.83 7.83,23.33 6.5,23.33 1.82,23.33 1.82,28 1.82,50.92 | 48.28,3.03 48.28,0.83 71.67,0.83 71.67,6.83 75,6.83 87.17,6.83 87.17,22.33 93.17,22.33 93.17,43 | BSK4.8 84.1,43 93.17,43 | BSK1.8 53.35,93.17 | BSK2.8 1.82,50.92
  Top 1: R25.2 C11.1
  Route15 0.3: v68.9,74.9 69.5,74.9
  Route15 0.4: v73,69.3 72.2,68.5 70.5,68.5 69.5,69.5 69.5,74.9 69.5,81 v70,81.5 | v43,37 52.38,37 v55,34.38
  Route15 0.5: v62.5,82 69.5,82 v70,81.5
  Bottom 0.4: v15,19.5 11,19.5 v6.5,24 | v13,76 9.56,76 v9.06,75.5 | v53,80.57 44.57,80.57 41.5,77.5 v41.5,72
  Bottom 0.6: U$21.P$3 v1.9,28
  Bottom 0.8: BSK3.8 48.28,15.4 66.45,15.4 MP1584EN-3V3.P$8 MP1584EN-3V3.P$7 | v2,54.92 v2,52.38
  pour Top (no thermals): 54.4,33 68.4,33 68.4,16 59.8,16 59.8,25.2 67.7,25.2 67.7,31.9 54.4,31.9
5V  (via drill 0.35, 0.55)
  Top 0.3: MP1584EN-5V.P$8 43.45,19 | 43.45,19 MP1584EN-5V.P$7 | 43.45,19 C1.2 37.98,19 C5.2 39.42,21.47 L_3.3-1.P$1 45,23.44 45,32.5 32.05,32.5 R28.2 | v39.73,79.77 40.27,79.77 41.3,78.73 41.3,78.1 40.43,77.23 U$5.3
  Top 0.4: LED_B1.A 73.45,45.55 v72.55,46.45 | v80.5,49 U$24.1
  Top 0.5: 14.09,38.69 U$1.10 | 11.45,36.05 11.5,36
  Top 0.8: v92,39.08 v92,36.92 | v59.51,92 v57.35,92 | v1.9,57.08 0.83,57.08 0.83,54.67 0.82,54.67 0.82,53.46 | v44.5,1.9 44.5,0.83 22.33,0.83 22.33,6.83 6.83,6.83 6.83,22.33 0.82,22.33 0.82,53.46 | 0.82,53.46 BSK2.7 12.53,50.83 12.53,43.49 14.79,41.23 U$1.9
  Top 1: R28.2 C16.1 | U$1.9 U$1.10 | CAM2.1 11.5,29.43 11.5,36 | 14.09,38.69 11.45,36.05 11.37,36.13 CAM1.1
  Route15 0.4: v72.55,46.45 75.1,49 v80.5,49 82.94,46.56 82.94,42.6 84.1,41.44 BSK4.7
  Bottom 0.3: v39.73,79.77 42.56,82.59 54.91,82.59 55.89,83.57 BSK1.7
  Bottom 0.6: BSK2.7 6.3,49.86 6.3,36.49 5.81,36 U$21.P$11
  Bottom 0.8: MP1584EN-5V.P$8 45.74,18.23 BSK3.7 45.74,1.83 | 45.74,1.83 70.67,1.83 70.67,7.83 86.17,7.83 86.17,23.37 92.17,23.37 92.17,36.92 v92,36.92 | v92,39.08 92.17,39.08 92.17,40.54 | 92.17,40.54 92.17,54.73 90.9,54.73 90.9,70.67 86.17,70.67 86.17,86.17 70.67,86.17 70.67,92.17 59.51,92.17 v59.51,92 | v57.35,92 57.35,92.17 55.89,92.17 | 55.89,92.17 23.33,92.17 23.33,86.17 7.83,86.17 7.83,70.67 1.83,70.67 1.83,57.08 v1.9,57.08 | BSK4.7 92.17,40.54 | BSK1.7 55.89,92.17 | v44.5,1.9 44.5,1.83 45.74,1.83
  pour Top (no thermals): 31.4,31.9 31.4,33 45.4,33 45.4,16 36.8,16 36.8,25.2 44.7,25.2 44.7,31.9
B1-CMD
  Top 0.3: 74HC595#1.3 63.98,79.07 63.27,79.07 62.62,79.72 62.62,80.78 63.51,81.67 BSK1.4
B1-KHEAT
  Top 0.3: BSK1.1 68.92,81.89 68.92,79.92 69.25,79.6 74HC595#1.15
B1-KVCC
  Top 0.3: 74HC595#1.1 64.74,80.25 BSK1.2
B1-ROZE
  Top 0.3: 74HC595#1.2 63.98,79.72 63.33,79.72 63.12,79.92 63.12,80.58 66.05,83.5 BSK1.3
B2-CMD  (via drill 0.35)
  Top 0.4: v61,76.61 61.26,76.35 74HC595#1.7
  Route15 0.4: v12,64.5 12,65.5 14.52,68.02 18.57,68.02 25.85,75.3 41.7,75.3 43.51,77.11 60.5,77.11 v61,76.61
  Bottom 0.4: BSK2.4 12,63.18 v12,64.5
B2-KHEAT  (via drill 0.35)
  Top 0.4: v62.15,79.15 63.01,78.3 74HC595#1.4
  Route15 0.4: v12,70 18,70 25.1,77.1 40.9,77.1 42.95,79.15 v62.15,79.15
  Bottom 0.4: BSK2.1 11.2,70 v12,70
B2-KVCC  (via drill 0.35)
  Top 0.4: v61.5,78.38 62,78.38 62.73,77.65 74HC595#1.5
  Route15 0.4: v12,69 12.22,69.22 18.07,69.22 25.35,76.5 41.2,76.5 43.18,78.48 61.4,78.48 v61.5,78.38
  Bottom 0.4: BSK2.2 12,68.26 v12,69
B2-ROZE  (via drill 0.35)
  Top 0.4: v61.89,77.39 62.27,77 74HC595#1.6
  Route15 0.4: v12,67 13.62,68.62 18.32,68.62 25.6,75.9 41.45,75.9 43.34,77.79 60.99,77.79 61.39,77.39 v61.89,77.39
  Bottom 0.4: BSK2.3 12,65.72 v12,67
B3-CMD  (via drill 0.35)
  Top 0.3: BSK3.4 40.09,11.87 66.38,11.87 v66.68,12.17 | v77.44,8.8 79.74,11.1 74HC595#2.3
  Bottom 0.3: v77.44,8.8 76.97,9.27 69.57,9.27 v66.68,12.17
B3-KHEAT  (via drill 0.35)
  Top 0.3: 74HC595#2.15 74.05,10.45 v73.5,11 | v68.57,14.46 66.27,14.46 65.27,13.46 34.06,13.46 BSK3.1
  Bottom 0.3: v73.5,11 73.3,10.8 70.23,10.8 68.57,12.46 v68.57,14.46
B3-KVCC  (via drill 0.35)
  Top 0.3: BSK3.2 36.07,12.93 65.54,12.93 66.34,13.73 v67.84,13.73 | v79.5,8.8 79.55,8.8 74HC595#2.1
  Bottom 0.3: v67.84,13.73 67.94,13.63 67.94,12.38 70.05,10.27 78.03,10.27 v79.5,8.8
B3-ROZE  (via drill 0.35)
  Top 0.3: BSK3.3 38.08,12.4 65.81,12.4 66.42,13 v67.22,13 | v78.47,8.8 78.47,9.1 79.82,10.45 74HC595#2.2
  Bottom 0.3: v67.22,13 67.42,12.8 67.42,12.2 69.84,9.77 77.5,9.77 v78.47,8.8
B4-CMD  (via drill 0.35)
  Top 0.3: 74HC595#2.7 80.57,13.72 81.42,13.72 81.92,14.21 v81.92,14.24
  Route15 0.3: BSK4.4 84.1,31.95 81.89,29.74 81.89,23.52 81.92,23.5 v81.92,14.24
B4-KHEAT  (via drill 0.35)
  Top 0.3: v83,12 82.75,11.75 74HC595#2.4
  Route15 0.3: BSK4.1 84.6,24.8 84.6,13.1 83.5,12 v83,12
B4-KVCC  (via drill 0.35)
  Top 0.3: v83.87,13.5 83.37,13.5 82.27,12.4 74HC595#2.5
  Route15 0.3: v83.87,13.5 83.87,22.96 82.89,23.94 82.89,26.63 BSK4.2
B4-ROZE  (via drill 0.35)
  Top 0.3: v83.14,14.22 81.97,13.05 74HC595#2.6
  Route15 0.3: BSK4.3 84.1,29.41 82.39,27.7 82.39,23.73 83.24,22.88 83.24,14.32 v83.14,14.22
B5-KHEAT  (via drill 0.35)
  Top 0.3: v12.5,77.5 74HC595#3.15
  Route15 0.3: v53,14.19 51.19,16 41.7,16 39.23,18.47 39.23,52 21.57,69.66 v21.57,69.93 | v18.27,72.37 13.15,77.5 v12.5,77.5
  Bottom 0.3: BSK3.10 53.36,13.83 v53,14.19 | v21.57,69.93 19.13,72.37 v18.27,72.37
BKU-KHEAT  (via drill 0.35)
  Top 0.3: 74HC595#4.15 71.65,76.35 v71.5,76.5 | v73,58.32 73,56.75 R32.2
  Bottom 0.3: v71.5,76.5 77.5,70.5 77.5,62.82 v73,58.32
BUS+
  Top 0.3: MP2225-5V.P$2 29.89,21.42 C6.2 | C6.2 29.47,21.79 R27.1 24.95,21.79 MP1584EN-5V.P$2 | C14.2 30.06,21.42 C6.2 | C9.2 50.02,21.4 R16.1 47.95,21.89 MP1584EN-3V3.P$2 | C9.2 52.88,21.4 MP2225-3V3.P$2 | C10.2 53.05,21.4 C9.2
  Bottom 0.6: 0.83,27.5 0.83,27 U$21.P$2 U$21.P$1 0.83,26
  Bottom 0.8: 42.09,18.5 42.09,17.67 43.2,16.55 BSK3.6 43.2,0.83 | 42.09,18.5 42.09,21.33 42.89,22.13 44.01,22.13 45.38,20.77 MP1584EN-3V3.P$2 MP1584EN-3V3.P$1 | MP1584EN-5V.P$2 MP1584EN-5V.P$1 41.82,18.23 42.09,18.5 | BSK2.6 0.83,56 | 0.83,56 0.83,27.5 0.83,26 0.83,22.33 6.34,22.33 6.83,21.84 6.83,6.83 21.84,6.83 22.33,6.34 22.33,1 22.5,0.83 43.2,0.83 | 43.2,0.83 71.67,0.83 71.67,6.34 72.16,6.83 87.17,6.83 87.17,22.37 93.17,22.37 93.17,38 | 0.83,56 0.83,67.33 0.82,67.33 0.82,71.67 6.83,71.67 6.83,87.17 22.33,87.17 22.33,93.17 58.43,93.17 | 93.17,38 93.17,55.73 91.9,55.73 91.9,71.67 87.17,71.67 87.17,87.17 71.67,87.17 71.67,93.17 58.43,93.17 | BSK1.6 58.43,93.17 | BSK4.6 93.17,38
  pour Top (rank 2, no thermals): 29.7,25.2 29.7,22.5 23,22.5 23,16 30.8,16 30.8,23.8 30.1,23.8 30.1,25.2
  pour Top (rank 2, no thermals): 52.7,25.2 52.7,22.5 46,22.5 46,16 53.8,16 53.8,23.8 53.1,23.8 53.1,25.2
BUSY  (via drill 0.35)
  Top 0.4: U$1.14 40.43,41.23 v41,41.8 | U$13.7 47.71,56.6 46.6,56.6 v45.6,55.6
  Route15 0.4: v41,41.8 41,47.7 43.08,49.78 43.08,53.08 v45.6,55.6
CS-RA  (via drill 0.35)
  Top 0.3: U$13.33 68.11,57.91
  Top 0.4: v68.4,58.2 68.11,57.91 | U$1.19 39.77,53.93 v42.3,51.4
  Route15 0.4: v68.4,58.2 64.8,61.8 50.5,61.8 42.3,53.6 v42.3,51.4
CS-SR  (via drill 0.35)
  Top 0.3: 74HC595#4.12 72.98,78.28 73.86,78.28 75.05,79.47 v75.15,79.37 | 74HC595#2.12 75.76,12.4 v76,12.16 | 74HC595#1.12 69.25,77.65 68.92,77.97 68.92,78.51 67.53,79.9 v66.9,79.9 | v15.5,78.94 15.27,79.17 15.1,79.17 14.82,79.45 74HC595#3.12 | U$13.31 63.93,55.37 v63.3,56
  Route15 0.3: v66.9,79.9 66.63,80.17 61.81,80.17 60.69,81.3 17.86,81.3 v15.5,78.94
  Bottom 0.3: v76,12.16 76,13.11 81.59,18.7 81.59,52.3 81.9,52.6 81.9,77.19 79.29,79.79 76.07,79.79 75.65,79.37 v75.15,79.37 74.62,79.9 v66.9,79.9 66.9,78.47 67.44,77.94 67.44,74.27 68.2,73.5 68.2,67.32 69,66.52 69,65.7 67.8,64.5 67.8,64.3 63.3,59.8 v63.3,56
DAT0  (via drill 0.35)
  Top 0.3: SD.DAT0 76.95,65.7 76.4,66.25 74.5,66.25 | 74.5,66.25 R23.2 | v62.2,49 62.7,48.5 62.7,46.77 U$13.24 | 74.5,66.25 74.7,66.45 v74.7,66.77
  Route15 0.3: v69.85,67.42 68.82,67.42 v67.5,66.1
  Bottom 0.3: U$21.P$10 11.39,35 39.31,62.93 47.11,62.93 61.04,49 v62.2,49 62.73,49.53 62.73,54.84 62.07,55.49 62.07,60.27 67.5,65.7 v67.5,66.1 | v74.7,66.77 74.05,67.42 v69.85,67.42
DAT1  (via drill 0.35)
  Top 0.3: R24.2 74.25,68.1 v74.7,68.1 76,66.8 SD.DAT1 | U$13.26 63.42,49.02 v63.4,49
  Route15 0.3: v69.49,68.31 69.37,68.2 v67.47,68.2
  Bottom 0.3: v63.4,49 63.4,54.87 62.57,55.7 62.57,59.98 68.5,65.91 68.5,66.17 67.67,67 67.67,68 v67.47,68.2 | v69.49,68.31 74.49,68.31 v74.7,68.1
DIO1  (via drill 0.35)
  Top 0.4: U$1.13 v41,38.7 | U$13.8 46.57,55.37 v45.6,54.4
  Route15 0.4: v41,38.7 41,40.2 41.78,40.98 41.78,47.63 43.68,49.53 43.68,52.48 v45.6,54.4
EN  (via drill 0.35)
  Top 0.3: U$13.3 45.62,61.72 v45.6,61.7 45.2,61.3 C4.1 R5.1
  Bottom 0.3: v45.6,61.7 39.5,61.7 6.8,29 U$21.P$4
GND  (via drill 0.35, 0.5, 0.55, 1 pad 1.6)
  Top 0.3: R4.2 72.95,52.7 U$23.2 | 46.64,64.26 45.4,65.5 C33.2 44.9,66.05 C3.2 44.9,69.25 R7.1 | C4.2 41.7,61.3 v41.2,60.8
  Top 0.4: 74HC595#1.13 71.01,78.3 71.59,77.72 72.93,77.72 74HC595#4.13
  Top 0.5: CAM2.2 8.5,31.77 8.5,37.27 CAM1.2
  Top 0.6: U$3.2 v74.7,69.5 | U$13.38 68.64,64.26 v68.7,64.2 | U$23.2 73,52.45 v73,49.6 | U$4.2 v17.1,24.8 | U$13.15 51.28,43.31 v51.3,43.3 | U$13.1 46.64,64.26 46.34,64.26 v45.8,64.8
  Top 1.5: v70.1,12.6 70.1,11.2 R33.1
  Route2 0.3: v74.7,69.5 69.5,64.3 69.5,64 | 70.1,33.5 v70.1,12.6 | 69.5,64 68.9,64 v68.7,64.2 | v41.2,60.8 45.2,64.8 v45.8,64.8 | 69.5,64 69.5,49.5 | 69.5,49.5 69.5,33.5 | v73,49.6 72.9,49.5 69.5,49.5
  Route2 0.6: v17.1,24.8 22.5,30.2 22.5,33.5 51.3,33.5 | 51.3,33.5 69.5,33.5 70.1,33.5 | v51.3,43.3 51.3,33.5 | v68.7,64.2 46.4,64.2 v45.8,64.8
  pour Route2 (isolate 0.3, rank 2): 11.5,82.5 82.5,82.5 82.5,11.5 68.5,11.5 68.5,33 23,33 23,11.5 11.5,11.5
  pour Top (rank 3, no thermals): -1.5,95.5 95.5,95.5 95.5,-1.5 -1.5,-1.5
  cutout Route2: 48,71.75 48,65.5 66,65.5 66,71.75
GND1-RADIO  (via drill 0.6)
  Top 1: v17.4,36.1 17.4,36.15 U$1.11 R19.1 | v17.4,51.4 U$1.5 | U$1.5 | U$1.5 U$1.4 17.4,53.93 v17.4,53.9 | U$1.1 17.4,66.58 v17.4,66.6 | v17.4,64.1 17.4,64.04 U$1.2 | U$1.3 v17.4,61.5 | U$1.22 36.6,66.58 v36.6,66.6 | U$1.20 v36.6,61.5 | U$1.12 36.6,36.15 v36.6,36.2
  Route2 1: v36.6,61.5 v36.6,66.6 v17.4,66.6 v17.4,64.1 v17.4,61.5 v17.4,53.9 v17.4,51.4 v17.4,36.1 17.4,36.2 v36.6,36.2
  pour Route2 (isolate 0.3, no thermals): 13.5,72 40.5,72 40.5,69 40.5,35 34,35 13.5,35 13.5,36
GND-OUT  (via drill 0.35, 0.5)
  Top 0.3: v25.4,25.2 v25.4,24.2 v25.4,23.2 v24.4,23.2 v24.4,24.2 v24.4,25.2 | v25.4,25.2 25.4,24.85 C17.1 29.24,24.85 MP2225-5V.P$1 | v35,23.7 v36,23.7 v36,24.7 v35,24.7 v34,24.7 v33,24.7 v32,24.7 31.22,24.7 MP2225-5V.P$4 | v35,23.7 v34,23.7 v33,23.7 v32,23.7 32.27,23.7 C6.1 31.76,21.42 C14.1 | v35,23.7 35,21.47 C5.1 35.18,19 C1.1 | MP1584EN-5V.P$6 MP1584EN-5V.P$5 | MP1584EN-5V.P$4 MP1584EN-5V.P$3 25.4,28.23 | 25.4,28.23 v25.4,25.2 | R29.2 27.15,28.23 25.4,28.23 | MP1584EN-3V3.P$4 MP1584EN-3V3.P$3 48.4,28.23 | C2.1 58.2,21 | 58.2,21 C13.1 | MP1584EN-3V3.P$5 MP1584EN-3V3.P$6 | v58,23.7 v59,23.7 v59,24.7 v58,24.7 v57,24.7 v56,24.7 v55,24.7 55,24.6 MP2225-3V3.P$4 | v58,23.7 v57,23.7 v56,23.7 v55,23.7 55,21.4 C9.1 55.3,19 C10.1 | v58,23.7 58,21 58.2,21 | R26.2 48.4,29.9 48.4,28.23 | 48.4,28.23 v48.4,25.2 | v48.4,25.2 v47.4,25.2 v47.4,24.2 v47.4,23.2 v48.4,23.2 v48.4,24.2 | v48.4,25.2 48.75,24.85 C8.1 50.25,24.6 MP2225-3V3.P$1
  Top 1.5: BSK3.14 66.1,9.9 R33.2
  Route2 0.3: MP1584EN-5V.P$5 MP1584EN-5V.P$4 | v32,24.7 25.4,24.7 v25.4,25.2 | v55,24.7 48.3,24.7 v48.4,23.2 | MP1584EN-3V3.P$5 MP1584EN-3V3.P$4
  Route2 0.6: MP1584EN-5V.P$6 MP1584EN-3V3.P$3 50.82,28.23 50.82,20.74 50.48,20.74 50.48,18.88 50.82,18.88 BSK3.9 50.82,0.73 | MP1584EN-3V3.P$4 MP1584EN-5V.P$5 | v3.5,30 v3.5,32 0.72,32 | 0.72,32 0.72,22.23 6.73,22.23 6.73,6.73 22.23,6.73 22.23,0.73 50.82,0.73 | 0.72,32 0.72,33 0.73,33 0.73,48.38 | 50.82,0.73 63.52,0.73 | 63.52,0.73 71.77,0.73 71.77,6.73 87.27,6.73 87.27,22.23 93.28,22.23 93.28,45.62 | 93.28,45.62 93.28,55.83 92,55.83 92,71.77 87.27,71.77 87.27,87.27 71.77,87.27 71.77,93.27 50.81,93.27 | 50.81,93.27 45.73,93.27 | 45.73,93.27 22.23,93.27 22.23,87.27 6.73,87.27 6.73,71.77 0.73,71.77 0.73,48.38 | BSK3.14 63.52,0.73 | BSK2.9 0.73,48.38 | BSK1.11 45.73,93.27 | BSK1.9 50.81,93.27 | BSK4.9 93.28,45.62
  Bottom 0.6: U$21.P$5 v3.5,30 | v3.5,32 U$21.P$7
  pour Top (no thermals): 31,25.2 36.5,25.2 36.5,16 31,16
  pour Top (no thermals): 42.5,31.6 44.4,31.6 44.4,25.5 42.5,25.5
  pour Top (no thermals): 29.4,22.7 29.4,25.5 26.3,25.5 26.3,27.4 27.9,27.4 27.9,33 23,33 23,22.7
  pour Top (no thermals): 54,25.2 59.5,25.2 59.5,16 54,16
  pour Top (no thermals): 65.5,31.6 67.4,31.6 67.4,25.5 65.5,25.5
  pour Top (no thermals): 52.4,22.7 52.4,25.5 49.3,25.5 49.3,27.4 50.9,27.4 50.9,33 46,33 46,22.7
  pour Route2 (isolate 0.3, rank 3, no thermals): -1,95 95,95 95,7 95,-1 55,-1 -1,-1
GND-RADIO
  Top 0.6: R19.2 U$4.3
GND-SD
  Top 0.6: R15.1 U$3.3
IO0-E  (via drill 0.35)
  Top 0.3: R6.1 67.85,46.6 v67.8,46.6 67.4,46.6 U$13.25
  Bottom 0.3: v67.8,46.6 62.73,46.6 46.9,62.43 39.52,62.43 11.09,34 U$21.P$9
IO1
  Top 0.3: R2.1 67.78,52.83 U$13.29
MISO
  Top 0.3: U$1.16 37.33,47.98 37.33,54.73 43.05,60.45 U$13.4
MOSI  (via drill 0.35)
  Top 0.3: v68.7,63.2 65.71,63.2 | 74HC595#3.14 14.85,78.15 v15.1,77.9
  Top 0.4: v41.1,48.9 41.05,48.85 U$1.17 | U$13.37 65.71,63.2
  Route15 0.3: v18.35,73.35 15.1,76.6 v15.1,77.9 | 40.2,53.2 22.62,70.78 v22.42,70.78
  Route15 0.4: v68.7,63.2 68.5,63 50,63 40.2,53.2 40.32,53.08 40.32,51.08 41.1,50.3 v41.1,48.9
  Bottom 0.3: v22.42,70.78 21.52,70.78 18.95,73.35 v18.35,73.35
MTCK  (via drill 0.35)
  Top 0.3: R21.2 74.45,59.7 76.39,59.7 76.89,60.2 SD.DAT3
  Top 0.4: U$13.16 52.98,47.17 52.98,47.92 57.34,52.28 v61,52.28 | v79.9,60.2 SD.DAT3
  Route15 0.4: v61,52.28 64.43,52.28 72.03,59.88 79.58,59.88 v79.9,60.2
MTDI  (via drill 0.35)
  Top 0.3: R18.2 72.95,59.1 SD.DAT2 | U$13.14 45.75,47.75 v45.7,47.8
  Top 0.4: v79.9,59.1 SD.DAT2
  Route15 0.4: v45.7,47.8 44.32,49.18 44.32,50.87 45.13,51.68 46.27,51.68 46.45,51.5 64.5,51.5 72.1,59.1 v79.9,59.1
MTDO  (via drill 0.35)
  Top 0.3: SD.CMD 76.45,61.3 R22.2
  Top 0.4: v62,53.1 62,50.9 61.37,50.27 61.37,46.83 U$13.23 | v79.9,61.3 SD.CMD
  Route15 0.4: v79.9,61.3 79.5,61.3 78.7,60.5 71.81,60.5 64.41,53.1 v62,53.1
MTMS  (via drill 0.35)
  Top 0.3: U$13.13 45.78,49.02 v45.7,49.1 | v80.7,63.5 SD.CLK
  Route15 0.4: v45.7,49.1 44.92,49.88 44.92,50.62 45.38,51.08 46.02,51.08 46.2,50.9 64.75,50.9 66.73,52.88 77.38,52.88 80.7,56.2 v80.7,63.5
N$1
  Top 0.3: 74HC595#1.9 70.6,75 73.61,75 74,75.39 74,76.66 73.66,77 74HC595#4.14
N$2
  Top 0.3: R3.1 LED_B1.C
N$3
  Top 0.3: R7.2 44.25,71.4 LED-G.C
N$4
  Top 0.3: R2.2 70.45,54 LED-B.C
N$5
  Top 0.3: SD.VSS 76.45,64.6 C12.1
  Top 0.6: SD.VSS 80.1,64.6 81.1,65.6 R15.2
N$6
  Top 0.3: U$4.1 14.05,23 R17.2 R14.2
N$7  (via drill 0.35, 0.4)
  Top 0.3: 74HC595#4.9 74,80.25 74.5,80.75 v74.5,81 | 74HC595#2.14 76.2,11.1 v76.3,11.2
  Bottom 0.3: v74.5,81 79.5,81 83,77.5 83,52.17 82.69,51.86 82.69,18.29 77.8,13.4 77.8,12.2 76.8,11.2 v76.3,11.2
N$8
  Top 0.3: MP2225-5V.P$3 30.54,26 33.97,26 C15.1 L_3.3-1.P$2
  pour Top (no thermals): 30.3,24 30.3,26.3 32.2,26.3 33.2,27.3 33.27,31.6 42.2,31.6 42.2,25.5 30.7,25.5 30.7,24
N$9
  Top 0.3: C15.2 31.19,27.84 MP2225-5V.P$5
  pour Top (no thermals): 31,26.6 31,28.8 32.9,28.8 32.9,27.4 32.1,26.6
N$10  (via drill 0.35)
  Top 0.4: MP2225-5V.P$6 30.54,28.08 v30.17,28.45 | v28.41,19.81 27.3,19.81 R27.2
  Bottom 0.4: v30.17,28.45 28.41,26.69 v28.41,19.81
N$11
  Top 0.3: U$3.1 73.4,72.45 R20.2 R31.2
N$12
  Top 0.4: C17.2 27.07,25.94 29.9,25.94 29.9,27.25 MP2225-5V.P$7
N$13
  pour Top (no thermals): 54,26.6 54,28.8 55.9,28.8 55.9,27.4 55.1,26.6
N$14
  pour Top (no thermals): 53.3,24 53.3,26.3 55.2,26.3 56.2,27.3 56.27,31.6 65.2,31.6 65.2,25.5 53.7,25.5 53.7,24
N$15  (via drill 0.35)
  Top 0.4: MP2225-3V3.P$6 53.54,28.08 v53.17,28.45 | v51.41,19.81 50.4,19.81 R16.2
  Bottom 0.4: v53.17,28.45 51.41,26.69 v51.41,19.81
N$16
  Top 0.4: C8.2 49.77,25.94 52.9,25.94 52.9,27.25 MP2225-3V3.P$7
N$17  (via drill 0.35)
  Top 0.3: 74HC595#1.14 69.78,79.07 69.07,79.07 68.19,79.95 v68.19,81.17 | v15.5,82 14.9,81.4 74HC595#3.9
  Route15 0.3: v68.19,81.17 62.23,81.17 61.1,82.3 15.8,82.3 v15.5,82
N$20
  Top 0.3: R25.1 C11.2 R26.1 52.23,29.9 MP2225-3V3.P$8
  pour Top (no thermals): 52.5,26.6 51.2,26.6 51.2,33 54.1,33 54.1,29.2 52.5,29.2
N$22
  Top 0.3: R28.1 C16.2 R29.1 29.24,29.9 MP2225-5V.P$8
  pour Top (no thermals): 29.5,26.6 28.2,26.6 28.2,33 31.1,33 31.1,29.2 29.5,29.2
N$36
  Top 0.3: U$23.1 74.65,52.6 R4.1 R32.1
NRST  (via drill 0.35)
  Top 0.3: 39,43.84 43.08,47.92 | 43.08,47.92 43.08,52.58 44.1,53.6 46.25,53.6 46.75,54.1 U$13.9 | 43.08,47.92 43.08,47.02 v42.56,46.5 | v43,41 R1.1
  Top 0.4: U$1.15 39,43.84
  Route15 0.3: v42.56,46.5 43,46.06 v43,41
PL1-KVCC
  Top 0.3: 74HC595#3.2 20.77,77.5 24.07,80.8 32.27,80.8 BSK1.15
PL2-KVCC
  Top 0.3: 74HC595#3.3 20.68,78.15 23.83,81.3 30.23,81.3 BSK1.16
PL3-KVCC
  Top 0.3: 74HC595#3.4 20.59,78.8 23.59,81.8 28.19,81.8 BSK1.17
PL4-KVCC
  Top 0.3: 74HC595#3.5 20.5,79.45 23.35,82.3 26.15,82.3 BSK1.18
PL5-KVCC
  Top 0.3: 74HC595#3.6 20.41,80.1 23.11,82.8 24.11,82.8 BSK1.19
PL6-KVCC
  Top 0.3: 74HC595#3.7 19.72,80.87 20.38,80.87 22.87,83.36 BSK1.20
RADIO  (via drill 0.35)
  Top 0.3: 74HC595#4.2 78.92,76.23 79.58,76.23 79.78,76.03 79.78,75.38 79.58,75.17 78.87,75.17 v78.6,74.9 | v17.1,23 R17.1
  Route15 0.3: v78.6,74.9 73.75,70.05 73.75,68.99 71.42,66.65 69.15,66.65 66.05,63.55 49.68,63.55 41.18,55.05 v40.95,55.05 | v36.5,53.6 18.5,35.6 18.5,24.4 v17.1,23
  Bottom 0.3: v40.95,55.05 37.95,55.05 v36.5,53.6
RX-E  (via drill 0.35)
  Top 0.3: v6.5,31 6.5,25.71 8.58,23.64 8.58,13.92 13.92,8.58 23.64,8.58 28.43,3.78 46.88,3.78 v47.2,4.1 | v68.7,59.2 68.68,59.18 U$13.34
  Bottom 0.3: U$21.P$6 v6.5,31 | v68.7,59.2 68.8,59.2 70,58 70,16.92 65.85,12.77 65.85,8.22 62.33,4.7 47.8,4.7 v47.2,4.1
RX-EN
  Top 0.3: 15,48.78 13.33,47.11 13.33,45.51 13.56,45.27 32.48,45.27 37.56,40.2 40.8,40.2 44.28,43.68 44.28,51.28 44.56,51.56 U$13.11
  Top 0.4: U$1.6 15,48.78
SCK  (via drill 0.35)
  Top 0.3: v68.7,61.7 65.52,61.7 | v71.61,78.8 71.76,78.95 74HC595#4.11 73.68,78.95 75,80.27 v75.5,80.27 | 74HC595#2.11 76.46,13.05 v76.94,12.57 | 74HC595#1.11 69.78,77.12 69.07,77.12 68.42,77.77 68.42,78.28 67.93,78.77 v67.63,78.77 | v15.4,79.9 15.2,80.1 74HC595#3.11
  Top 0.4: U$1.18 v41.09,51.39 v41.1,51.4 | U$13.36 65.52,61.7
  Route15 0.3: v67.63,78.77 67.63,80.37 67.33,80.67 62.02,80.67 60.89,81.8 17.3,81.8 v15.4,79.9
  Route15 0.4: v68.7,61.7 68,62.4 50.25,62.4 41.1,53.25 v41.1,51.4
  Bottom 0.3: v76.94,12.57 76.94,13.25 82.1,18.41 82.1,52.1 82.5,52.5 82.5,77.29 79.4,80.4 75.62,80.4 v75.5,80.27 | v71.61,78.8 68,78.8 | 68,78.8 67.66,78.8 v67.63,78.77 | 68,78.8 68,74.41 68.73,73.68 68.73,67.5 69.5,66.73 69.5,62.3 68.9,61.7 v68.7,61.7
SCL-TM  (via drill 0.35)
  Top 0.3: R10.2 69.25,50.3 v68.7,50.3
  Top 0.4: v68.7,50.3 65.51,50.3 U$13.27
  Route15 0.4: BSK2.10 11.11,45.84 | BSK1.10 48.27,82.89 | 11.11,45.84 11.11,82.51 11.49,82.89 48.27,82.89 | BSK4.10 82.89,48.16 82.89,82.57 82.57,82.89 48.27,82.89 | BSK3.12 58.44,11.11 | 11.11,45.84 11.11,11.43 11.43,11.11 58.44,11.11 | v68.7,50.3 68.72,50.3 69,50.02 69,15.4 69.54,14.87 69.54,13.89 66.76,11.11 58.44,11.11
SD  (via drill 0.35)
  Top 0.3: R31.1 v70.9,69.3 | v77.5,75 78.2,75.7 74HC595#4.1
  Route15 0.3: v70.9,69.3 76.6,75 v77.5,75
SDA-TM  (via drill 0.35)
  Top 0.3: R11.2 69.55,51.5 v68.7,51.5
  Top 0.35: v68.7,51.5 68.64,51.56 U$13.28
  Route15 0.4: BSK4.11 85.31,50.7 85.31,82.77 85.8,83.25 85.8,85.01 85.01,85.8 83.25,85.8 82.77,85.31 43.19,85.31 | 60.98,8.69 11.23,8.69 10.75,8.2 9.25,8.2 8.2,9.25 8.2,43.3 | 8.2,43.3 8.2,84.75 9.25,85.8 10.75,85.8 11.23,85.31 43.19,85.31 | BSK1.12 43.19,85.31 | BSK2.11 8.2,43.3 | BSK3.13 60.98,8.69 | 60.98,8.69 68.31,8.69 71.45,11.82 71.45,13.8 69.6,15.65 69.6,50.57 68.7,51.47 v68.7,51.5
SINS-KVCC  (via drill 0.35)
  Top 0.3: v19.5,76 19.5,76.75 74HC595#3.1
  Route15 0.3: v54.03,14.19 51.72,16.5 42,16.5 39.73,18.77 39.73,52.62 v22.63,69.72
  Bottom 0.3: BSK3.11 55.9,12.32 v54.03,14.19 | v19.5,76 19.5,73.53 21.52,71.5 22.73,71.5 23.15,71.08 23.15,70.28 22.63,69.75 v22.63,69.72
TIME  (via drill 0.35)
  Top 0.3: U$13.30 62.4,54.1 v62,54.5
  Bottom 0.3: v62,54.5 56.24,54.5 47.32,63.43 46,63.43 38.11,71.32 BSK1.14
TIME-ES  (via drill 0.35)
  Top 0.3: U$13.5 49.48,59.18 50.93,60.63 v50.93,60.93
  Bottom 0.3: BSK1.13 39,82.45 39,72.87 v50.93,60.93
TX-E  (via drill 0.35)
  Top 0.3: v6.5,33 7.23,32.27 7.23,30.7 7,30.47 7,25.92 9.08,23.84 9.08,14.13 14.13,9.08 23.84,9.08 28.64,4.28 46.28,4.28 v47.2,5.2 | v68.7,60.5 68.65,60.45 U$13.35
  Bottom 0.3: U$21.P$8 v6.5,33 | v47.2,5.2 62.12,5.2 65.35,8.43 65.35,12.98 69.5,17.13 69.5,54.77 66.67,57.6 66.67,59.5 67.67,60.5 v68.7,60.5
TX-EN
  Top 0.3: U$1.7 19,46.31 | 19,46.31 33.99,46.31 37.56,42.73 40.44,42.73 43.68,45.98 43.68,52.18 44.33,52.83 U$13.10 | 19,46.31

### Text on the board
tPlace: to BSK1 | PWR | ON | to BSK2 | IO1 | HEATER | ON | SDA-TM | SCL-TM | G | 5V | G | 5V | to BSK4 | to BSK3
bPlace: for / firmware